# EAGLE design lia (EAGLE 6.2)

## Sheet 1 of 3
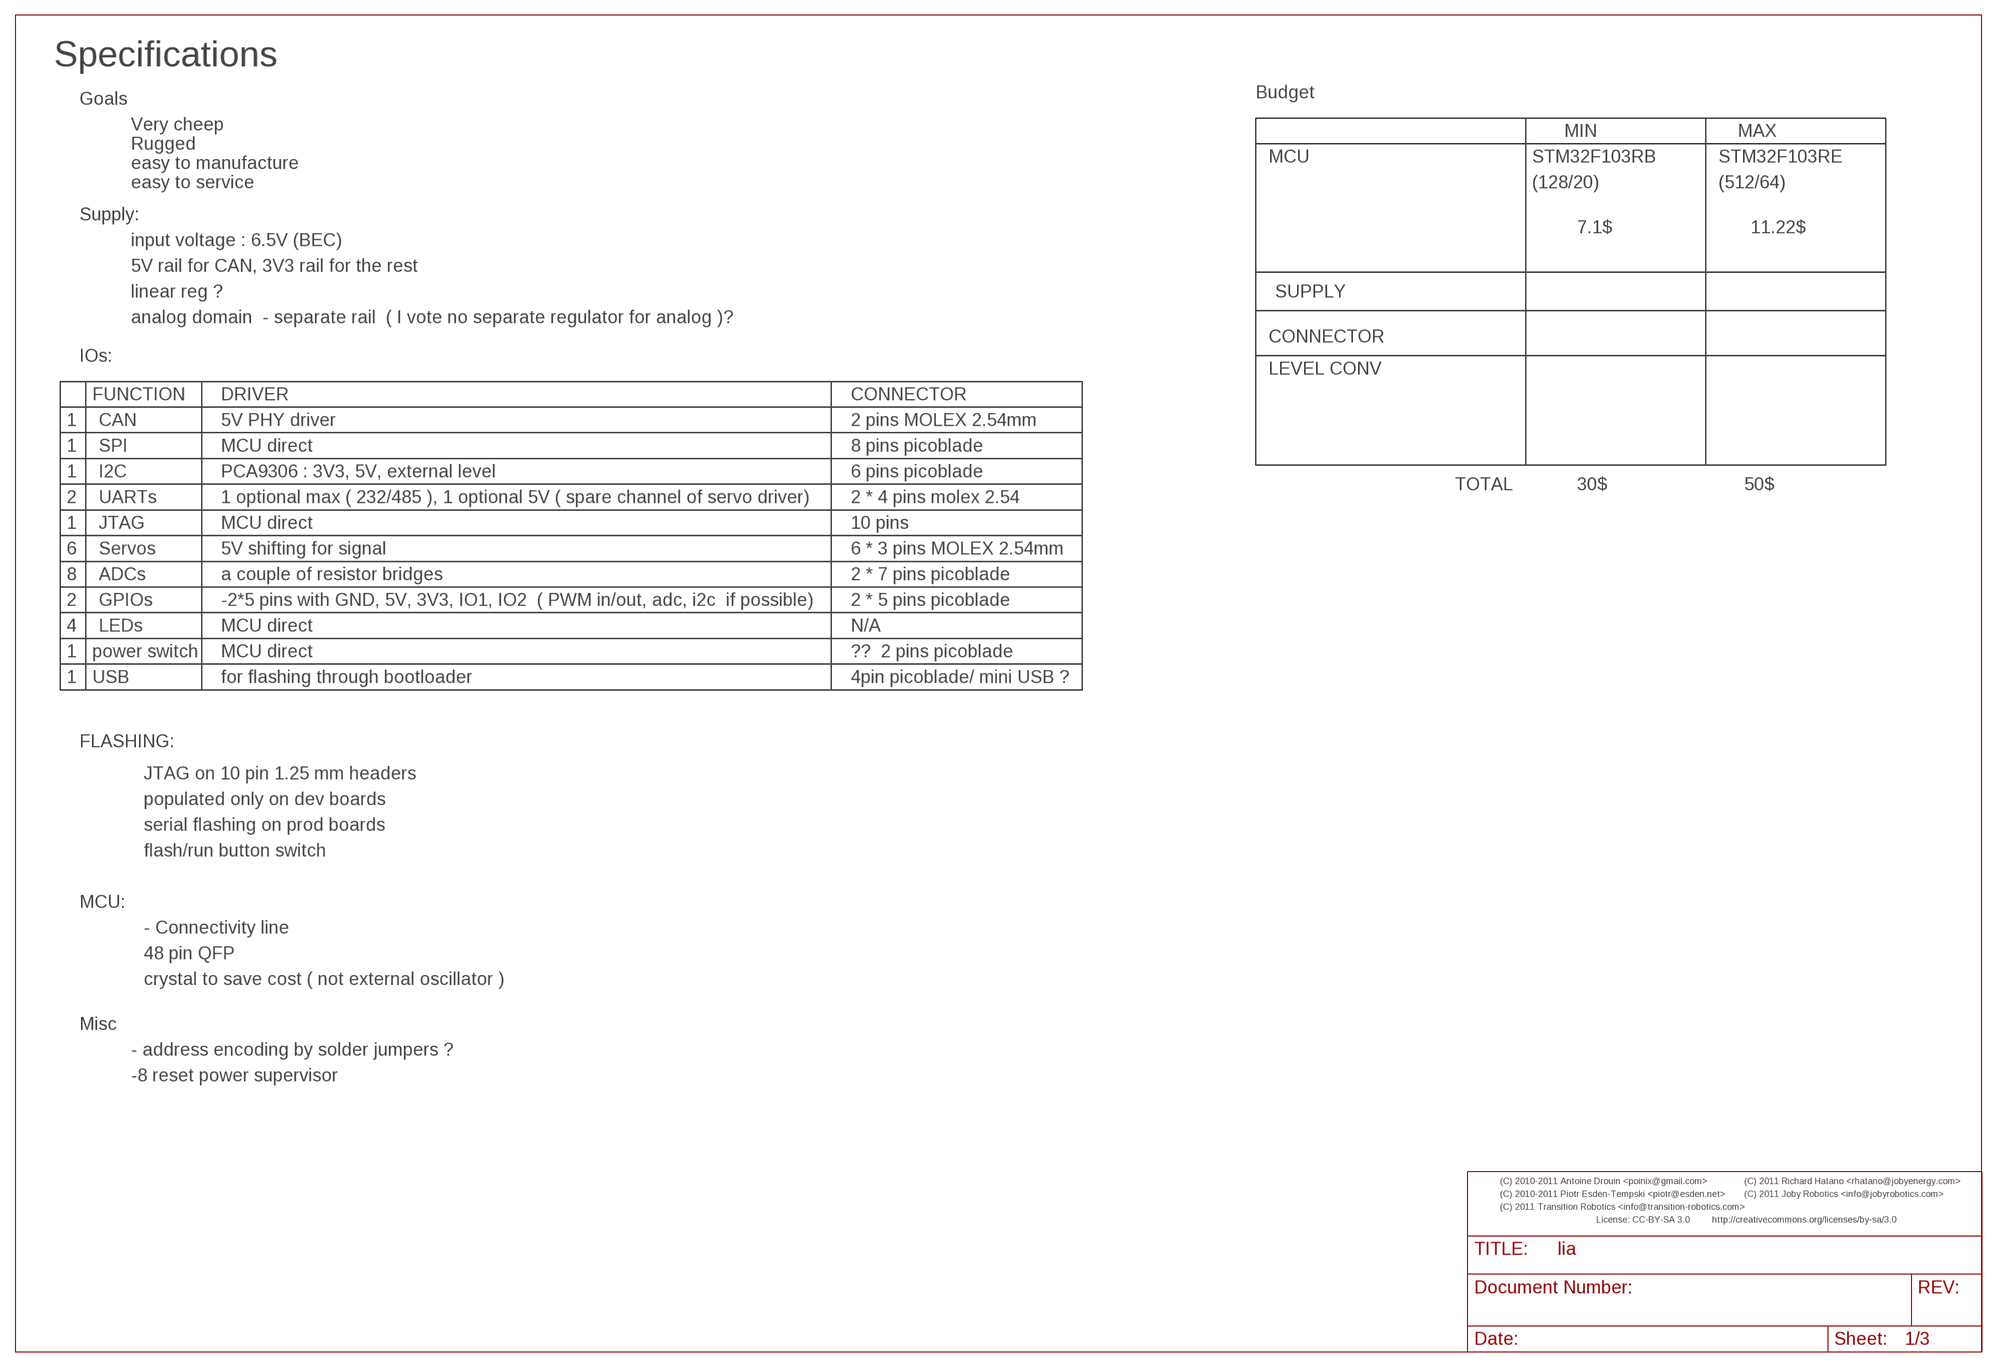
[diagram p0: schematic, sheet 1]

### Notes on the sheet
- Specifications
- Budget
- Goals
- Very cheep
- MIN | MAX
- Rugged
- MCU | STM32F103RB | STM32F103RE
- easy to manufacture
- easy to service | (128/20) | (512/64)
- Supply:
- 7.1$ | 11.22$
- input voltage : 6.5V (BEC)
- 5V rail for CAN, 3V3 rail for the rest
- linear reg ? | SUPPLY
- analog domain  - separate rail  ( I vote no separate regulator for analog )?
- CONNECTOR
- IOs:
- LEVEL CONV
- FUNCTION | DRIVER | CONNECTOR
- 1 | CAN | 5V PHY driver | 2 pins MOLEX 2.54mm
- 1 | SPI | MCU direct | 8 pins picoblade
- 1 | I2C | PCA9306 : 3V3, 5V, external level | 6 pins picoblade
- TOTAL | 30$ | 50$
- 2 | UARTs | 1 optional max ( 232/485 ), 1 optional 5V ( spare channel of servo driver) | 2 * 4 pins molex 2.54
- 1 | JTAG | MCU direct | 10 pins
- 6 | Servos | 5V shifting for signal | 6 * 3 pins MOLEX 2.54mm
- 8 | ADCs | a couple of resistor bridges | 2 * 7 pins picoblade
- 2 | GPIOs | -2*5 pins with GND, 5V, 3V3, IO1, IO2  ( PWM in/out, adc, i2c  if possible) | 2 * 5 pins picoblade
- 4 | LEDs | MCU direct | N/A
- 1 | power switch | MCU direct | ??  2 pins picoblade
- 1 | USB | for flashing through bootloader | 4pin picoblade/ mini USB ?
- FLASHING:
- JTAG on 10 pin 1.25 mm headers
- populated only on dev boards
- serial flashing on prod boards
- flash/run button switch
- MCU:
- - Connectivity line
- 48 pin QFP
- crystal to save cost ( not external oscillator )
- Misc
- - address encoding by solder jumpers ?
- -8 reset power supervisor
- (C) 2010-2011 Antoine Drouin <poinix@gmail.com> | (C) 2011 Richard Hatano <rhatano@jobyenergy.com>
- (C) 2010-2011 Piotr Esden-Tempski <piotr@esden.net> | (C) 2011 Joby Robotics <info@jobyrobotics.com>
- (C) 2011 Transition Robotics <info@transition-robotics.com>
- License: CC-BY-SA 3.0 | http://creativecommons.org/licenses/by-sa/3.0

## Sheet 2 of 3
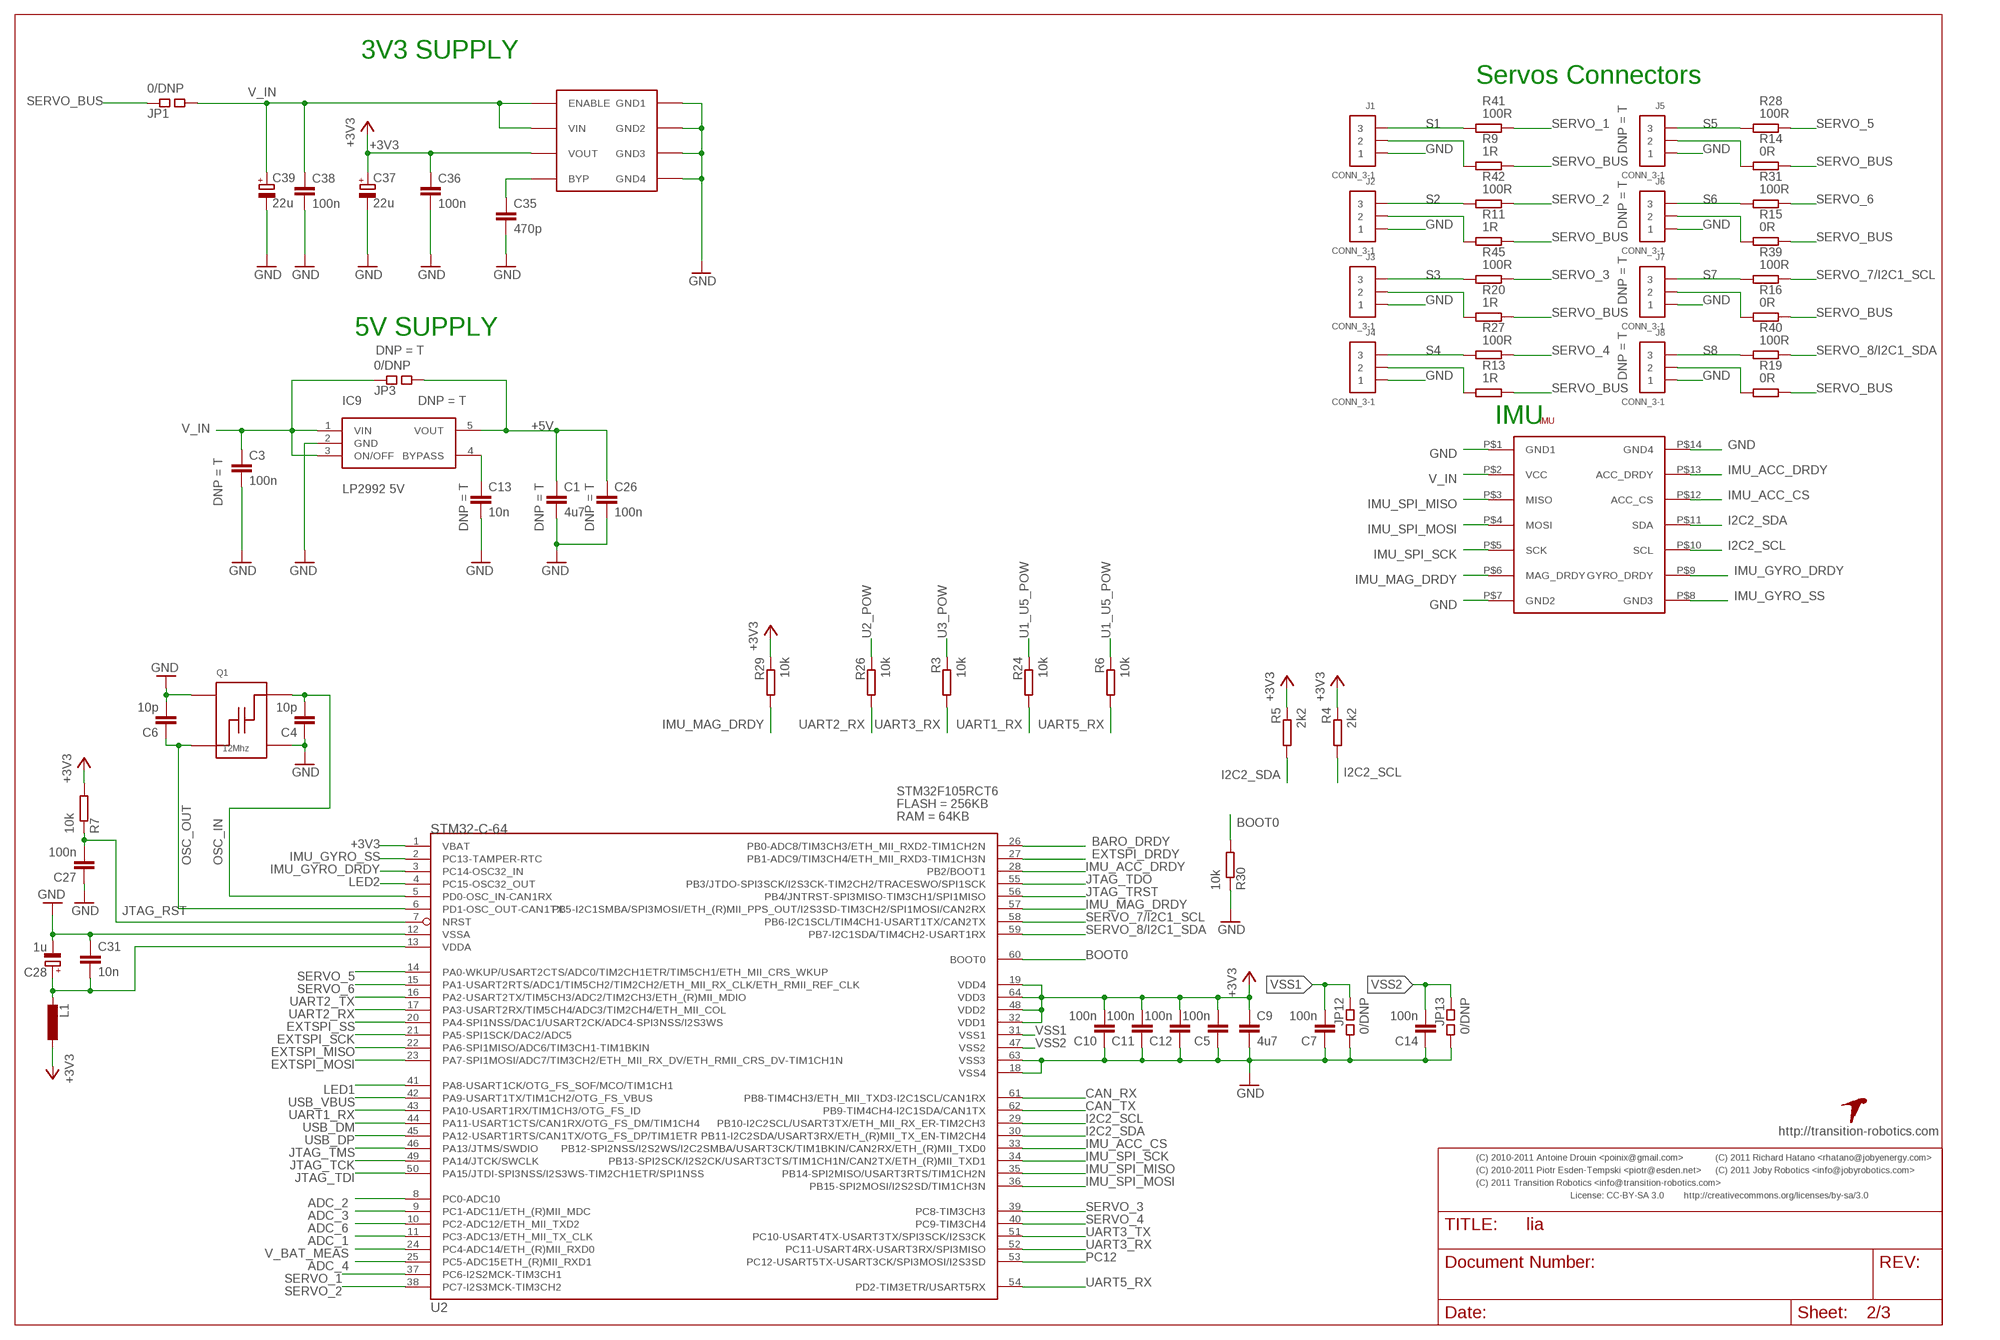
[diagram p1: schematic, sheet 2]

### Parts
C1  4u7  CAPACITOR-0805  [0805-CAP]
C3  100n  CAPACITOR-0603  [0603-CAP]
C4  10p  CAPACITOR-0402  [0402-CAP]
C5  100n  CAPACITOR-0402  [0402-CAP]
C6  10p  CAPACITOR-0402  [0402-CAP]
C7  100n  CAPACITOR-0402  [0402-CAP]
C9  4u7  CAPACITOR-0805  [0805-CAP]
C10  100n  CAPACITOR-0402  [0402-CAP]
C11  100n  CAPACITOR-0402  [0402-CAP]
C12  100n  CAPACITOR-0402  [0402-CAP]
C13  10n  CAPACITOR-0402  [0402-CAP]
C14  100n  CAPACITOR-0402  [0402-CAP]
C26  100n  CAPACITOR-0603  [0603-CAP]
C27  100n  CAPACITOR-0402  [0402-CAP]
C28  1u  CAPACITOR-POL-0603  [0603-POL-CAP]
C31  10n  CAPACITOR-0402  [0402-CAP]
C35  470p  CAPACITOR-0402  [0402-CAP]
C36  100n  CAPACITOR-0603  [0603-CAP]
C37  22u  CAPACITOR-POLB  [3528/B]
C38  100n  CAPACITOR-0402  [0402-CAP]
C39  22u  CAPACITOR-POLB  [3528/B]
IC9  LP2992 5V  LP2992  [SOT23-5]
IMU  ASPIRIN  [ASPIRIN_1]
J1  CONN_3-1  [SIP1X3_100]
J2  CONN_3-1  [SIP1X3_100]
J3  CONN_3-1  [SIP1X3_100]
J4  CONN_3-1  [SIP1X3_100]
J5  CONN_3-1  [SIP1X3_100]
J6  CONN_3-1  [SIP1X3_100]
J7  CONN_3-1  [SIP1X3_100]
J8  CONN_3-1  [SIP1X3_100]
JP1  0/DNP  SQ_JMP-0402  [0402-SQJMP]
JP3  0/DNP  SQ_JMP-0402  [0402-SQJMP]
JP12  0/DNP  SQ_JMP-0402  [0402-SQJMP]
JP13  0/DNP  SQ_JMP-0402  [0402-SQJMP]
L1  INDUCTOR-0603  [0603-IND]
Q1  12Mhz  ABM8  [ABM8]
R3  10k  RESISTOR-0402  [0402-RES]
R4  2k2  RESISTOR-0402  [0402-RES]
R5  2k2  RESISTOR-0402  [0402-RES]
R6  10k  RESISTOR-0402  [0402-RES]
R7  10k  RESISTOR-0402  [0402-RES]
R9  1R  RESISTOR-1206  [1206-RES]
R11  1R  RESISTOR-1206  [1206-RES]
R13  1R  RESISTOR-1206  [1206-RES]
R14  0R  RESISTOR-1206  [1206-RES]
R15  0R  RESISTOR-1206  [1206-RES]
R16  0R  RESISTOR-1206  [1206-RES]
R19  0R  RESISTOR-1206  [1206-RES]
R20  1R  RESISTOR-1206  [1206-RES]
R24  10k  RESISTOR-0402  [0402-RES]
R26  10k  RESISTOR-0402  [0402-RES]
R27  100R  RESISTOR-0402  [0402-RES]
R28  100R  RESISTOR-0402  [0402-RES]
R29  10k  RESISTOR-0402  [0402-RES]
R30  10k  RESISTOR-0402  [0402-RES]
R31  100R  RESISTOR-0402  [0402-RES]
R39  100R  RESISTOR-0402  [0402-RES]
R40  100R  RESISTOR-0402  [0402-RES]
R41  100R  RESISTOR-0402  [0402-RES]
R42  100R  RESISTOR-0402  [0402-RES]
R45  100R  RESISTOR-0402  [0402-RES]
U2  STM32-C-64  [LQFP64]
U$1  TR-LOGO  [TR-LOGO]
VREG1  MIC5209  [SOIC8]

### Nets
+3V3: C5.P$2 C9.P$1 C10.P$2 C11.P$2 C12.P$2 C36.P$1 C37.+ L1.P$1 R4.P$1 R5.P$1 R7.P$2 R29.P$1 U2.1(VBAT) U2.19(VDD4) U2.32(VDD1) U2.48(VDD2) U2.64(VDD3) VREG1.3(VOUT) ; also sheet 3
+5V: C1.P$1 C26.P$1 IC9.5(VOUT) JP3.P$2 ; also sheet 3
ADC_1: U2.11(PC3-ADC13/ETH_MII_TX_CLK) ; also sheet 3
ADC_2: U2.8(PC0-ADC10) ; also sheet 3
ADC_3: U2.9(PC1-ADC11/ETH_(R)MII_MDC) ; also sheet 3
ADC_4: U2.25(PC5-ADC15ETH_(R)MII_RXD1) ; also sheet 3
ADC_6: U2.10(PC2-ADC12/ETH_MII_TXD2) ; also sheet 3
BARO_DRDY: U2.26(PB0-ADC8/TIM3CH3/ETH_MII_RXD2-TIM1CH2N)
BOOT0: R30.P$2 U2.60(BOOT0) ; also sheet 3
CAN_RX: U2.61(PB8-TIM4CH3/ETH_MII_TXD3-I2C1SCL/CAN1RX) ; also sheet 3
CAN_TX: U2.62(PB9-TIM4CH4-I2C1SDA/CAN1TX) ; also sheet 3
EXTSPI_DRDY: U2.27(PB1-ADC9/TIM3CH4/ETH_MII_RXD3-TIM1CH3N) ; also sheet 3
EXTSPI_MISO: U2.22(PA6-SPI1MISO/ADC6/TIM3CH1-TIM1BKIN) ; also sheet 3
EXTSPI_MOSI: U2.23(PA7-SPI1MOSI/ADC7/TIM3CH2/ETH_MII_RX_DV/ETH_RMII_CRS_DV-TIM1CH1N) ; also sheet 3
EXTSPI_SCK: U2.21(PA5-SPI1SCK/DAC2/ADC5) ; also sheet 3
EXTSPI_SS: U2.20(PA4-SPI1NSS/DAC1/USART2CK/ADC4-SPI3NSS/I2S3WS) ; also sheet 3
GND: C1.P$2 C3.P$2 C4.P$1 C5.P$1 C6.P$2 C7.P$1 C9.P$2 C10.P$1 C11.P$1 C12.P$1 C13.P$2 C14.P$1 C26.P$2 C27.P$1 C28.- C31.P$1 C35.P$2 C36.P$2 C37.- C38.P$2 C39.- IC9.2(GND) IMU.P$1(GND1) IMU.P$7(GND2) IMU.P$14(GND4) J1.1 J2.1 J3.1 J4.1 J5.1 J6.1 J7.1 J8.1 JP12.P$2 JP13.P$2 Q1.P$2 Q1.P$4 R30.P$1 U2.12(VSSA) U2.18(VSS4) U2.63(VSS3) VREG1.5(GND4) VREG1.6(GND3) VREG1.7(GND2) VREG1.8(GND1) ; also sheet 3
I2C2_SCL: IMU.P$10(SCL) R4.P$2 U2.29(PB10-I2C2SCL/USART3TX/ETH_MII_RX_ER-TIM2CH3) ; also sheet 3
I2C2_SDA: IMU.P$11(SDA) R5.P$2 U2.30(PB11-I2C2SDA/USART3RX/ETH_(R)MII_TX_EN-TIM2CH4) ; also sheet 3
IMU_ACC_CS: IMU.P$12(ACC_CS) U2.33(PB12-SPI2NSS/I2S2WS/I2C2SMBA/USART3CK/TIM1BKIN/CAN2RX/ETH_(R)MII_TXD0)
IMU_ACC_DRDY: IMU.P$13(ACC_DRDY) U2.28(PB2/BOOT1)
IMU_GYRO_DRDY: IMU.P$9(GYRO_DRDY) U2.3(PC14-OSC32_IN)
IMU_GYRO_SS: IMU.P$8(GND3) U2.2(PC13-TAMPER-RTC)
IMU_MAG_DRDY: IMU.P$6(MAG_DRDY) R29.P$2 U2.57(PB5-I2C1SMBA/SPI3MOSI/ETH_(R)MII_PPS_OUT/I2S3SD-TIM3CH2/SPI1MOSI/CAN2RX)
IMU_SPI_MISO: IMU.P$3(MISO) U2.35(PB14-SPI2MISO/USART3RTS/TIM1CH2N)
IMU_SPI_MOSI: IMU.P$4(MOSI) U2.36(PB15-SPI2MOSI/I2S2SD/TIM1CH3N)
IMU_SPI_SCK: IMU.P$5(SCK) U2.34(PB13-SPI2SCK/I2S2CK/USART3CTS/TIM1CH1N/CAN2TX/ETH_(R)MII_TXD1)
JTAG_RST: C27.P$2 R7.P$1 U2.7(NRST) ; also sheet 3
JTAG_TCK: U2.49(PA14/JTCK/SWCLK) ; also sheet 3
JTAG_TDI: U2.50(PA15/JTDI-SPI3NSS/I2S3WS-TIM2CH1ETR/SPI1NSS) ; also sheet 3
JTAG_TDO: U2.55(PB3/JTDO-SPI3SCK/I2S3CK-TIM2CH2/TRACESWO/SPI1SCK) ; also sheet 3
JTAG_TMS: U2.46(PA13/JTMS/SWDIO) ; also sheet 3
JTAG_TRST: U2.56(PB4/JNTRST-SPI3MISO-TIM3CH1/SPI1MISO) ; also sheet 3
LED1: U2.41(PA8-USART1CK/OTG_FS_SOF/MCO/TIM1CH1) ; also sheet 3
LED2: U2.4(PC15-OSC32_OUT) ; also sheet 3
N$2: J5.2 R14.P$1
N$3: J6.2 R15.P$1
N$6: C13.P$1 IC9.4(BYPASS)
N$7: C35.P$1 VREG1.4(BYP)
N$16: J7.2 R16.P$1
N$17: J8.2 R19.P$1
N$18: J4.2 R13.P$1
N$19: J3.2 R20.P$1
N$20: J2.2 R11.P$1
N$21: J1.2 R9.P$1
OSC_IN: C4.P$2 Q1.P$3 U2.5(PD0-OSC_IN-CAN1RX)
OSC_OUT: C6.P$1 Q1.P$1 U2.6(PD1-OSC_OUT-CAN1TX)
PC12: U2.53(PC12-USART5TX-USART3CK/SPI3MOSI/I2S3SD) ; also sheet 3
S1: J1.3 R41.P$1
S2: J2.3 R42.P$1
S3: J3.3 R45.P$1
S4: J4.3 R27.P$1
S5: J5.3 R28.P$1
S6: J6.3 R31.P$1
S7: J7.3 R39.P$1
S8: J8.3 R40.P$1
SERVO_1: R41.P$2 U2.37(PC6-I2S2MCK-TIM3CH1)
SERVO_2: R42.P$2 U2.38(PC7-I2S3MCK-TIM3CH2)
SERVO_3: R45.P$2 U2.39(PC8-TIM3CH3)
SERVO_4: R27.P$2 U2.40(PC9-TIM3CH4)
SERVO_5: R28.P$2 U2.14(PA0-WKUP/USART2CTS/ADC0/TIM2CH1ETR/TIM5CH1/ETH_MII_CRS_WKUP)
SERVO_6: R31.P$2 U2.15(PA1-USART2RTS/ADC1/TIM5CH2/TIM2CH2/ETH_MII_RX_CLK/ETH_RMII_REF_CLK)
SERVO_7/I2C1_SCL: R39.P$2 U2.58(PB6-I2C1SCL/TIM4CH1-USART1TX/CAN2TX) ; also sheet 3
SERVO_8/I2C1_SDA: R40.P$2 U2.59(PB7-I2C1SDA/TIM4CH2-USART1RX) ; also sheet 3
SERVO_BUS: JP1.P$1 R9.P$2 R11.P$2 R13.P$2 R14.P$2 R15.P$2 R16.P$2 R19.P$2 R20.P$2
U1_U5_POW: R6.P$1 R24.P$1 ; also sheet 3
U2_POW: R26.P$1 ; also sheet 3
U3_POW: R3.P$1 ; also sheet 3
UART1_RX: R24.P$2 U2.43(PA10-USART1RX/TIM1CH3/OTG_FS_ID) ; also sheet 3
UART2_RX: R26.P$2 U2.17(PA3-USART2RX/TIM5CH4/ADC3/TIM2CH4/ETH_MII_COL) ; also sheet 3
UART2_TX: U2.16(PA2-USART2TX/TIM5CH3/ADC2/TIM2CH3/ETH_(R)MII_MDIO) ; also sheet 3
UART3_RX: R3.P$2 U2.52(PC11-USART4RX-USART3RX/SPI3MISO) ; also sheet 3
UART3_TX: U2.51(PC10-USART4TX-USART3TX/SPI3SCK/I2S3CK) ; also sheet 3
UART5_RX: R6.P$2 U2.54(PD2-TIM3ETR/USART5RX) ; also sheet 3
USB_DM: U2.44(PA11-USART1CTS/CAN1RX/OTG_FS_DM/TIM1CH4) ; also sheet 3
USB_DP: U2.45(PA12-USART1RTS/CAN1TX/OTG_FS_DP/TIM1ETR) ; also sheet 3
USB_VBUS: U2.42(PA9-USART1TX/TIM1CH2/OTG_FS_VBUS) ; also sheet 3
V_BAT_MEAS: U2.24(PC4-ADC14/ETH_(R)MII_RXD0) ; also sheet 3
V_IN: C3.P$1 C38.P$1 C39.+ IC9.1(VIN) IC9.3(ON/OFF) IMU.P$2(VCC) JP1.P$2 JP3.P$1 VREG1.1(ENABLE) VREG1.2(VIN) ; also sheet 3
VDDA: C28.+ C31.P$2 L1.P$2 U2.13(VDDA)
VSS1: C7.P$2 JP12.P$1 U2.31(VSS1)
VSS2: C14.P$2 JP13.P$1 U2.47(VSS2)

### Notes on the sheet
- 3V3 SUPPLY
- Servos Connectors
- 5V SUPPLY
- IMU
- http://transition-robotics.com
- (C) 2010-2011 Antoine Drouin <poinix@gmail.com> | (C) 2011 Richard Hatano <rhatano@jobyenergy.com>
- (C) 2010-2011 Piotr Esden-Tempski <piotr@esden.net> | (C) 2011 Joby Robotics <info@jobyrobotics.com>
- (C) 2011 Transition Robotics <info@transition-robotics.com>
- License: CC-BY-SA 3.0 | http://creativecommons.org/licenses/by-sa/3.0

## Sheet 3 of 3
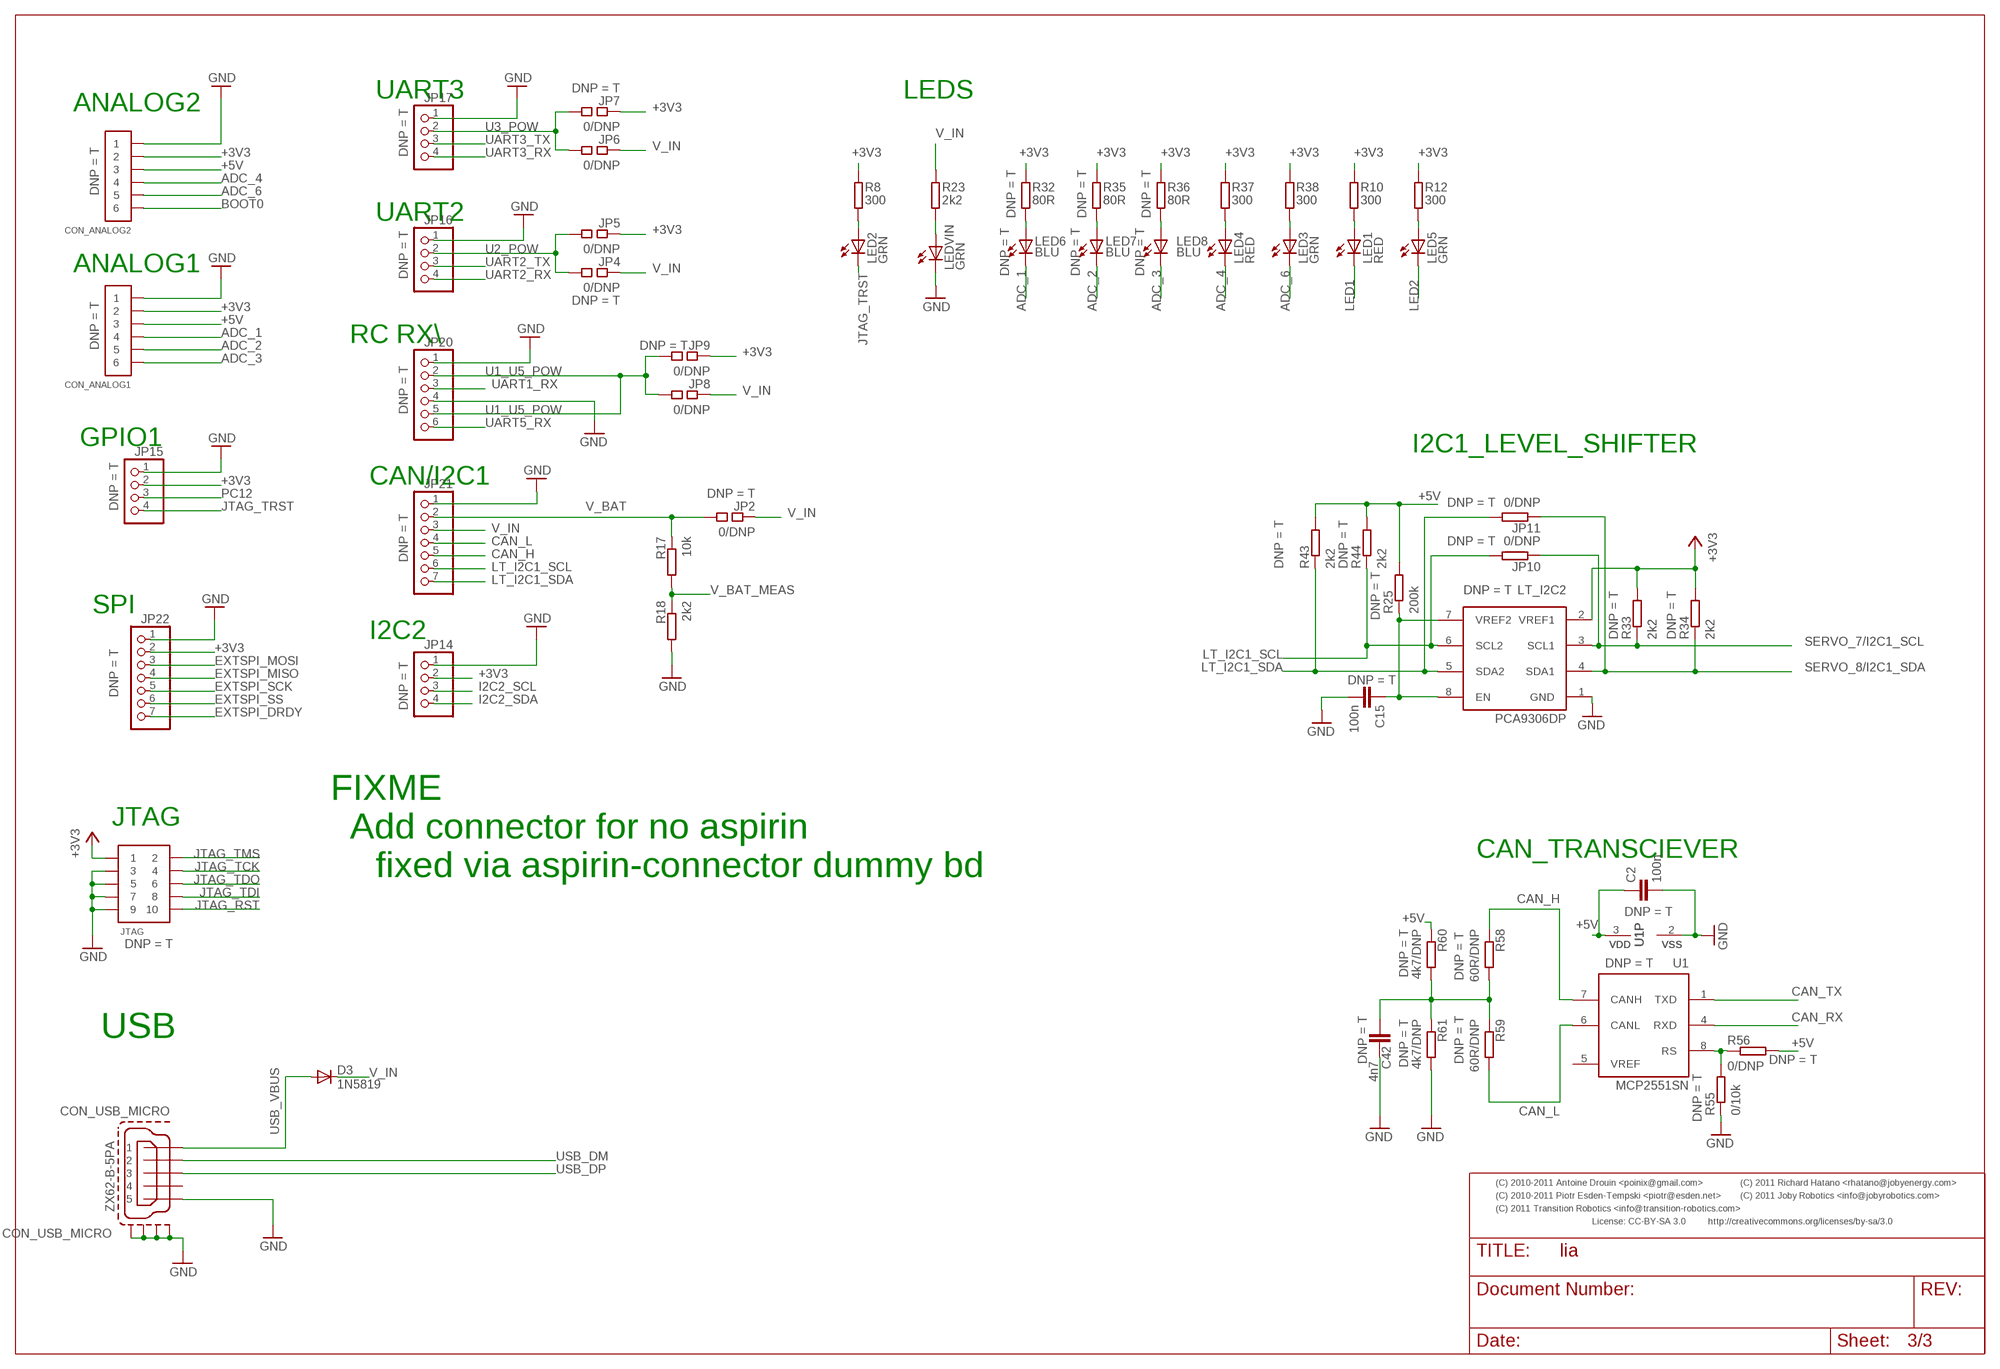
[diagram p2: schematic, sheet 3]

### Parts
C2  100n  CAPACITOR-0402  [0402-CAP]
C15  100n  CAPACITOR-0402  [0402-CAP]
C42  4n7  CAPACITOR-0603  [0603-CAP]
CON_ANALOG1  CONN_6-1-53398  [PB-53398-06]
CON_ANALOG2  CONN_6-1-53398  [PB-53398-06]
CON_USB_MICRO  ZX62-B-5PA  [ZX62-B-5PA]
D3  1N5819  DIODE-MICROMELF-R  [MICROMELF-R]
JP2  0/DNP  SQ_JMP-0402  [0402-SQJMP]
JP4  0/DNP  SQ_JMP-0402  [0402-SQJMP]
JP5  0/DNP  SQ_JMP-0402  [0402-SQJMP]
JP6  0/DNP  SQ_JMP-0402  [0402-SQJMP]
JP7  0/DNP  SQ_JMP-0402  [0402-SQJMP]
JP8  0/DNP  SQ_JMP-0402  [0402-SQJMP]
JP9  0/DNP  SQ_JMP-0402  [0402-SQJMP]
JP10  0/DNP  RESISTOR-0603  [0603-RES]
JP11  0/DNP  RESISTOR-0603  [0603-RES]
JP14  PINHD-1X4  [1X04]
JP15  PINHD-1X4  [1X04]
JP16  PINHD-1X4  [1X04]
JP17  PINHD-1X4  [1X04]
JP20  PINHD-1X6  [1X06]
JP21  PINHD-1X7  [1X07]
JP22  PINHD-1X7  [1X07]
JTAG  PIN_HDR_EDG_1.27MM_5-2  CONN_5-2-FTSH-V  [FTSH-105-DV]
LED1  RED  LED-0402  [0402-LED]
LED2  GRN  LED-0402  [0402-LED]
LED3  GRN  LED-0402  [0402-LED]
LED4  RED  LED-0402  [0402-LED]
LED5  GRN  LED-0402  [0402-LED]
LED6  BLU  LED-0402  [0402-LED]
LED7  BLU  LED-0402  [0402-LED]
LED8  BLU  LED-0402  [0402-LED]
LEDVIN  GRN  LED-0402  [0402-LED]
LT_I2C2  PCA9306DP  [TSSOP_B3]
R8  300  RESISTOR-0402  [0402-RES]
R10  300  RESISTOR-0402  [0402-RES]
R12  300  RESISTOR-0402  [0402-RES]
R17  10k  RESISTOR-0402  [0402-RES]
R18  2k2  RESISTOR-0402  [0402-RES]
R23  2k2  RESISTOR-0402  [0402-RES]
R25  200k  RESISTOR-0402  [0402-RES]
R32  80R  RESISTOR-0402  [0402-RES]
R33  2k2  RESISTOR-0402  [0402-RES]
R34  2k2  RESISTOR-0402  [0402-RES]
R35  80R  RESISTOR-0402  [0402-RES]
R36  80R  RESISTOR-0402  [0402-RES]
R37  300  RESISTOR-0402  [0402-RES]
R38  300  RESISTOR-0402  [0402-RES]
R43  2k2  RESISTOR-0402  [0402-RES]
R44  2k2  RESISTOR-0402  [0402-RES]
R55  0/10k  RESISTOR-0402  [0402-RES]
R56  0/DNP  RESISTOR-0402  [0402-RES]
R58  60R/DNP  RESISTOR-0402  [0402-RES]
R59  60R/DNP  RESISTOR-0402  [0402-RES]
R60  4k7/DNP  RESISTOR-0402  [0402-RES]
R61  4k7/DNP  RESISTOR-0402  [0402-RES]
U1  MCP2551SN  [SO-08]

### Nets
+3V3: CON_ANALOG1.2 CON_ANALOG2.2 JP5.P$1 JP7.P$1 JP9.P$1 JP14.2 JP15.2 JP22.2 JTAG.1 LT_I2C2.2(VREF1) R8.P$2 R10.P$2 R12.P$2 R32.P$2 R33.P$2 R34.P$2 R35.P$2 R36.P$2 R37.P$2 R38.P$2 ; also sheet 2
+5V: C2.P$1 CON_ANALOG1.3 CON_ANALOG2.3 R25.P$2 R43.P$2 R44.P$2 R56.P$2 R60.P$1 U1.3(VDD) ; also sheet 2
ADC_1: CON_ANALOG1.4 LED6.C ; also sheet 2
ADC_2: CON_ANALOG1.5 LED7.C ; also sheet 2
ADC_3: CON_ANALOG1.6 LED8.C ; also sheet 2
ADC_4: CON_ANALOG2.4 LED4.C ; also sheet 2
ADC_6: CON_ANALOG2.5 LED3.C ; also sheet 2
BOOT0: CON_ANALOG2.6 ; also sheet 2
CAN_CENTER: C42.P$2 R58.P$2 R59.P$1 R60.P$2 R61.P$1
CAN_H: JP21.5 R58.P$1 U1.7(CANH)
CAN_L: JP21.4 R59.P$2 U1.6(CANL)
CAN_RX: U1.4(RXD) ; also sheet 2
CAN_TX: U1.1(TXD) ; also sheet 2
EXTSPI_DRDY: JP22.7 ; also sheet 2
EXTSPI_MISO: JP22.4 ; also sheet 2
EXTSPI_MOSI: JP22.3 ; also sheet 2
EXTSPI_SCK: JP22.5 ; also sheet 2
EXTSPI_SS: JP22.6 ; also sheet 2
GND: C2.P$2 C15.P$2 C42.P$1 CON_ANALOG1.1 CON_ANALOG2.1 CON_USB_MICRO.GND_LEFT(S1) CON_USB_MICRO.GND_RIGHT(S2) CON_USB_MICRO.GND_UP_LEFT(S3) CON_USB_MICRO.GND_UP_RIGHT(S4) CON_USB_MICRO.PIN_5 JP14.1 JP15.1 JP16.1 JP17.1 JP20.1 JP20.4 JP21.1 JP22.1 JTAG.3 JTAG.5 JTAG.7 JTAG.9 LEDVIN.C LT_I2C2.1(GND) R18.P$2 R55.P$1 R61.P$2 U1.2(VSS) ; also sheet 2
I2C2_SCL: JP14.3 ; also sheet 2
I2C2_SDA: JP14.4 ; also sheet 2
JTAG_RST: JTAG.10 ; also sheet 2
JTAG_TCK: JTAG.4 ; also sheet 2
JTAG_TDI: JTAG.8 ; also sheet 2
JTAG_TDO: JTAG.6 ; also sheet 2
JTAG_TMS: JTAG.2 ; also sheet 2
JTAG_TRST: JP15.4 LED2.C ; also sheet 2
LED1: LED1.C ; also sheet 2
LED2: LED5.C ; also sheet 2
LT_I2C1_SCL: JP10.P$2 JP21.6 LT_I2C2.6(SCL2) R44.P$1
LT_I2C1_SDA: JP11.P$2 JP21.7 LT_I2C2.5(SDA2) R43.P$1
N$1: R55.P$2 R56.P$1 U1.8(RS)
N$4: LED1.A R10.P$1
N$5: LED6.A R32.P$1
N$8: C15.P$1 LT_I2C2.7(VREF2) LT_I2C2.8(EN) R25.P$1
N$9: LED7.A R35.P$1
N$10: LED2.A R8.P$1
N$11: LED8.A R36.P$1
N$12: LEDVIN.A R23.P$1
N$13: LED5.A R12.P$1
N$14: LED4.A R37.P$1
N$15: LED3.A R38.P$1
PC12: JP15.3 ; also sheet 2
SERVO_7/I2C1_SCL: JP10.P$1 LT_I2C2.3(SCL1) R33.P$1 ; also sheet 2
SERVO_8/I2C1_SDA: JP11.P$1 LT_I2C2.4(SDA1) R34.P$1 ; also sheet 2
U1_U5_POW: JP8.P$2 JP9.P$2 JP20.2 JP20.5 ; also sheet 2
U2_POW: JP4.P$2 JP5.P$2 JP16.2 ; also sheet 2
U3_POW: JP6.P$2 JP7.P$2 JP17.2 ; also sheet 2
UART1_RX: JP20.3 ; also sheet 2
UART2_RX: JP16.4 ; also sheet 2
UART2_TX: JP16.3 ; also sheet 2
UART3_RX: JP17.4 ; also sheet 2
UART3_TX: JP17.3 ; also sheet 2
UART5_RX: JP20.6 ; also sheet 2
USB_DM: CON_USB_MICRO.PIN_2 ; also sheet 2
USB_DP: CON_USB_MICRO.PIN_3 ; also sheet 2
USB_VBUS: CON_USB_MICRO.PIN_1 D3.A ; also sheet 2
V_BAT: JP2.P$2 JP21.2 R17.P$1
V_BAT_MEAS: R17.P$2 R18.P$1 ; also sheet 2
V_IN: D3.C JP2.P$1 JP4.P$1 JP6.P$1 JP8.P$1 JP21.3 R23.P$2 ; also sheet 2
Unconnected: CON_USB_MICRO.PIN_4

### Notes on the sheet
- ANALOG2 | UART3 | LEDS
- UART2
- ANALOG1
- RC RX\
- GPIO1 | I2C1_LEVEL_SHIFTER
- CAN/I2C1
- SPI
- I2C2
- FIXME
- JTAG
- Add connector for no aspirin
- CAN_TRANSCIEVER
- fixed via aspirin-connector dummy bd
- USB
- (C) 2010-2011 Antoine Drouin <poinix@gmail.com> | (C) 2011 Richard Hatano <rhatano@jobyenergy.com>
- (C) 2010-2011 Piotr Esden-Tempski <piotr@esden.net> | (C) 2011 Joby Robotics <info@jobyrobotics.com>
- (C) 2011 Transition Robotics <info@transition-robotics.com>
- License: CC-BY-SA 3.0 | http://creativecommons.org/licenses/by-sa/3.0

## Power pins joined to a net without a drawn wire
VREF: U1.5(VREF)

## Library data of the parts
C1 = pel_dipol_comp:CAPACITOR; DNP: T; PARTNO: cap-cer-0805-4u7
C2 C15 = pel_dipol_comp:CAPACITOR; DNP: T; PARTNO: cap-cer-0402-100n
C3 C26 = pel_dipol_comp:CAPACITOR; DNP: T; PARTNO: cap-cer-0603-100n
C4 C6 = pel_dipol_comp:CAPACITOR; PARTNO: cap-cer-0402-10p
C5 C7 C10-C12 C14 C27 C38 = pel_dipol_comp:CAPACITOR; PARTNO: cap-cer-0402-100n
C9 = pel_dipol_comp:CAPACITOR; PARTNO: cap-cer-0805-4u7
C13 = pel_dipol_comp:CAPACITOR; DNP: T; PARTNO: cap-cer-0402-10n
C28 = pel_dipol_comp:CAPACITOR-POL; PARTNO: cap-tan-0603-1u
C31 = pel_dipol_comp:CAPACITOR; PARTNO: cap-cer-0402-10n
C35 = pel_dipol_comp:CAPACITOR; PARTNO: cap-cer-0402-470p
C36 = pel_dipol_comp:CAPACITOR; PARTNO: cap-cer-0603-100n
C37 C39 = pel_dipol_comp:CAPACITOR-POL; PARTNO: cap-tan-B-22u-16v
C42 = pel_dipol_comp:CAPACITOR; DNP: T; PARTNO: cap-cer-0603-4n7
CON_ANALOG1 CON_ANALOG2 = pel_molex:CONN_6-1; DNP: T; PARTNO: conn-picoblade-smd-0.05in-6-vert
CON_USB_MICRO = open-bldc:ZX62-B-5PA; PARTNO: conn-smd-usb-micro-b
D3 = diode:DIODE-: DIODE; PARTNO: diode-schottky-1608
IC9 = open-bldc:LP2992; DNP: T; PARTNO: vreg-sot-23-5-5v
IMU = joby_robotics:ASPIRIN; PARTNO: pcb-ass-aspirin
J1-J4 = pel_misc:CONN_3-1; PARTNO: conn-th-0.1in-3-2-ra
J5-J8 = pel_misc:CONN_3-1; DNP: T; PARTNO: conn-th-0.1in-3-2-ra
JP1 JP5 JP6 JP8 JP12 JP13 = pel_jumpers:SQ_JMP; PARTNO: res-0402-0
JP2-JP4 JP7 JP9 = pel_jumpers:SQ_JMP; DNP: T; PARTNO: res-0402-0
JP10 JP11 = pel_dipol_comp:RESISTOR; DNP: T; PARTNO: res-0603-0
JP14-JP17 = pinhead:PINHD-1X4: PIN HEADER; DNP: T; PARTNO: conn-th-0.1in-4-1
JP20 = pinhead:PINHD-1X6: PIN HEADER; DNP: T; PARTNO: conn-th-0.1in-6-1
JP21 JP22 = pinhead:PINHD-1X7: PIN HEADER; DNP: T; PARTNO: conn-th-0.1in-7-1
JTAG = pel_misc:CONN_5-2; DNP: T; PARTNO: conn-smd-0.05in-5-2
L1 = res_cap:INDUCTOR; PARTNO: ferrite-0603-600ohm
LED1 LED4 = pel_dipol_comp:LED; PARTNO: led-0402-red
LED2 LED3 LED5 LEDVIN = pel_dipol_comp:LED; PARTNO: led-0402-green
LED6-LED8 = pel_dipol_comp:LED; DNP: T; PARTNO: led-0402-blue
LT_I2C2 = booz:PCA9306: Dual bidirectional I2C-bus and SMBus voltage-level translator; DNP: T; PARTNO: ic-tssop8-level-trans
Q1 = booz:ABM8; PARTNO: xtal-abm8-12mhz
R3 R6 R7 R17 R24 R26 R29 R30 = pel_dipol_comp:RESISTOR; PARTNO: res-0402-10k
R4 R5 R18 R23 = pel_dipol_comp:RESISTOR; PARTNO: res-0402-2k2
R8 R10 R12 R37 R38 = pel_dipol_comp:RESISTOR; PARTNO: res-0402-300
R9 R11 R13 R20 = pel_dipol_comp:RESISTOR; PARTNO: res-1206-1
R14-R16 R19 = pel_dipol_comp:RESISTOR; PARTNO: res-1206-0
R25 = pel_dipol_comp:RESISTOR; DNP: T; PARTNO: res-0402-200k
R27 R28 R31 R39-R42 R45 = pel_dipol_comp:RESISTOR; PARTNO: res-0402-100
R32 R35 R36 = pel_dipol_comp:RESISTOR; DNP: T; PARTNO: res-0402-80
R33 R34 = pel_dipol_comp:RESISTOR; DNP: T; PARTNO: res-0402-2k2
R43 R44 = pel_dipol_comp:RESISTOR; DNP: T; PARTNO: res-0402-1k5
R55 = pel_dipol_comp:RESISTOR; DNP: T; PARTNO: res-0402-10k
R56 = pel_dipol_comp:RESISTOR; DNP: T; PARTNO: res-0402-0
R58 R59 = pel_dipol_comp:RESISTOR; DNP: T; PARTNO: res-0402-60.4
R60 R61 = pel_dipol_comp:RESISTOR; DNP: T; PARTNO: res-0402-4k7
U1 = microchip_can:MCP2551: High Speed CAN tranceiver; DNP: T; PARTNO: ic-so8-can
U2 = pel_stm32:STM32-C-64; FLASH: 256KB; PARTNO: mcu-lqfp-64-stm32; PART_NR: STM32F105RCT6; RAM: 64KB
U$1 = quadshot:TR-LOGO; BOM: EXCLUDE; PARTNO: *
VREG1 = paparazzi:MIC5209; PARTNO: vreg-so8-3v3

## Net classes
0 default: width 0.152 mm, drill 0.305 mm, clearance 0.152 mm

## Board
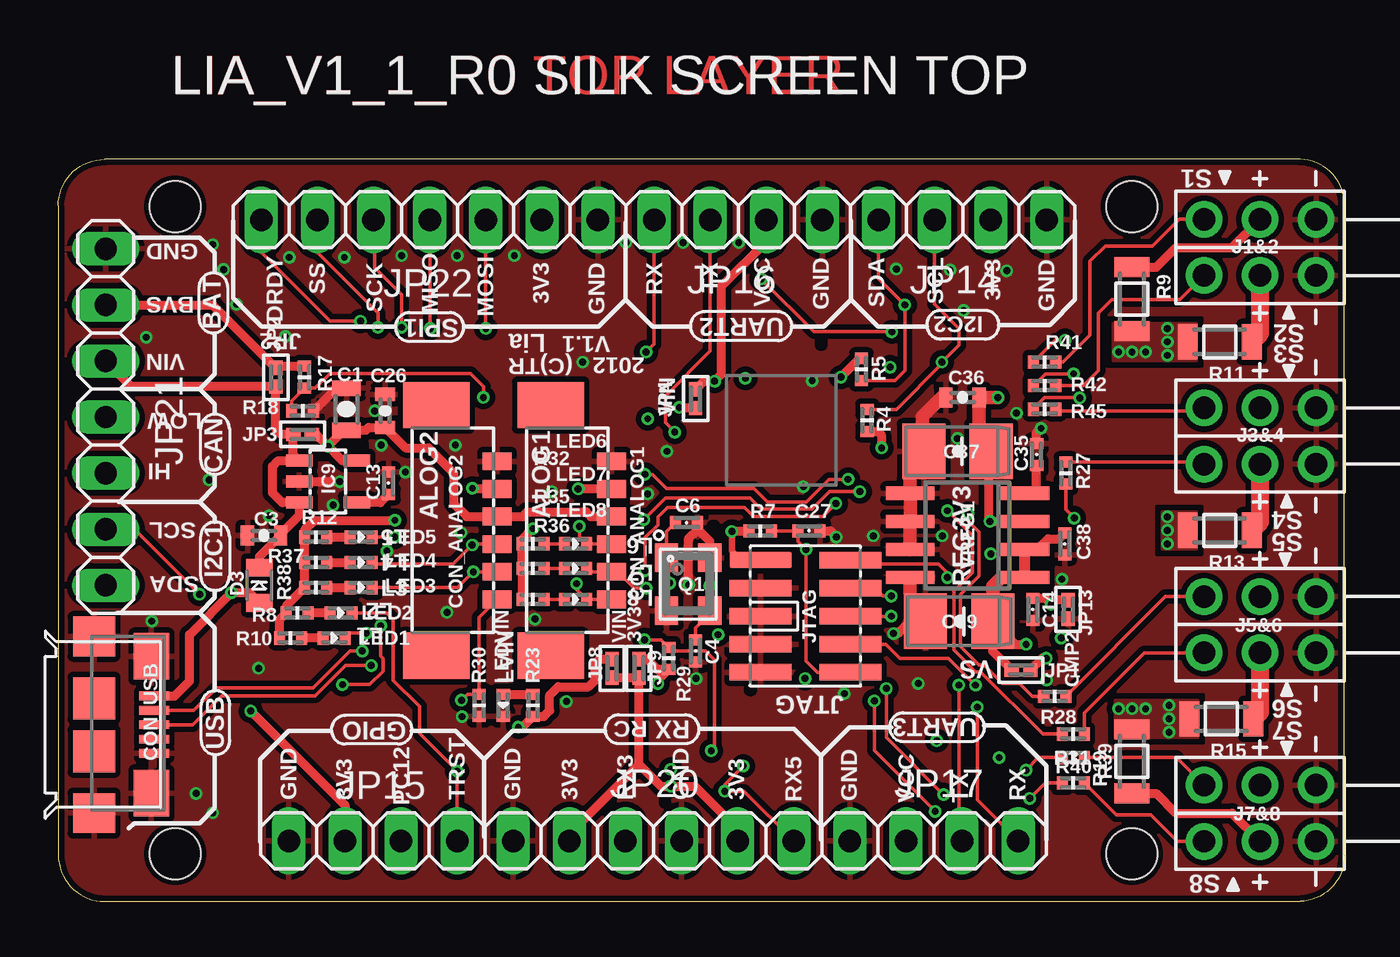
[diagram p3: board, top side]
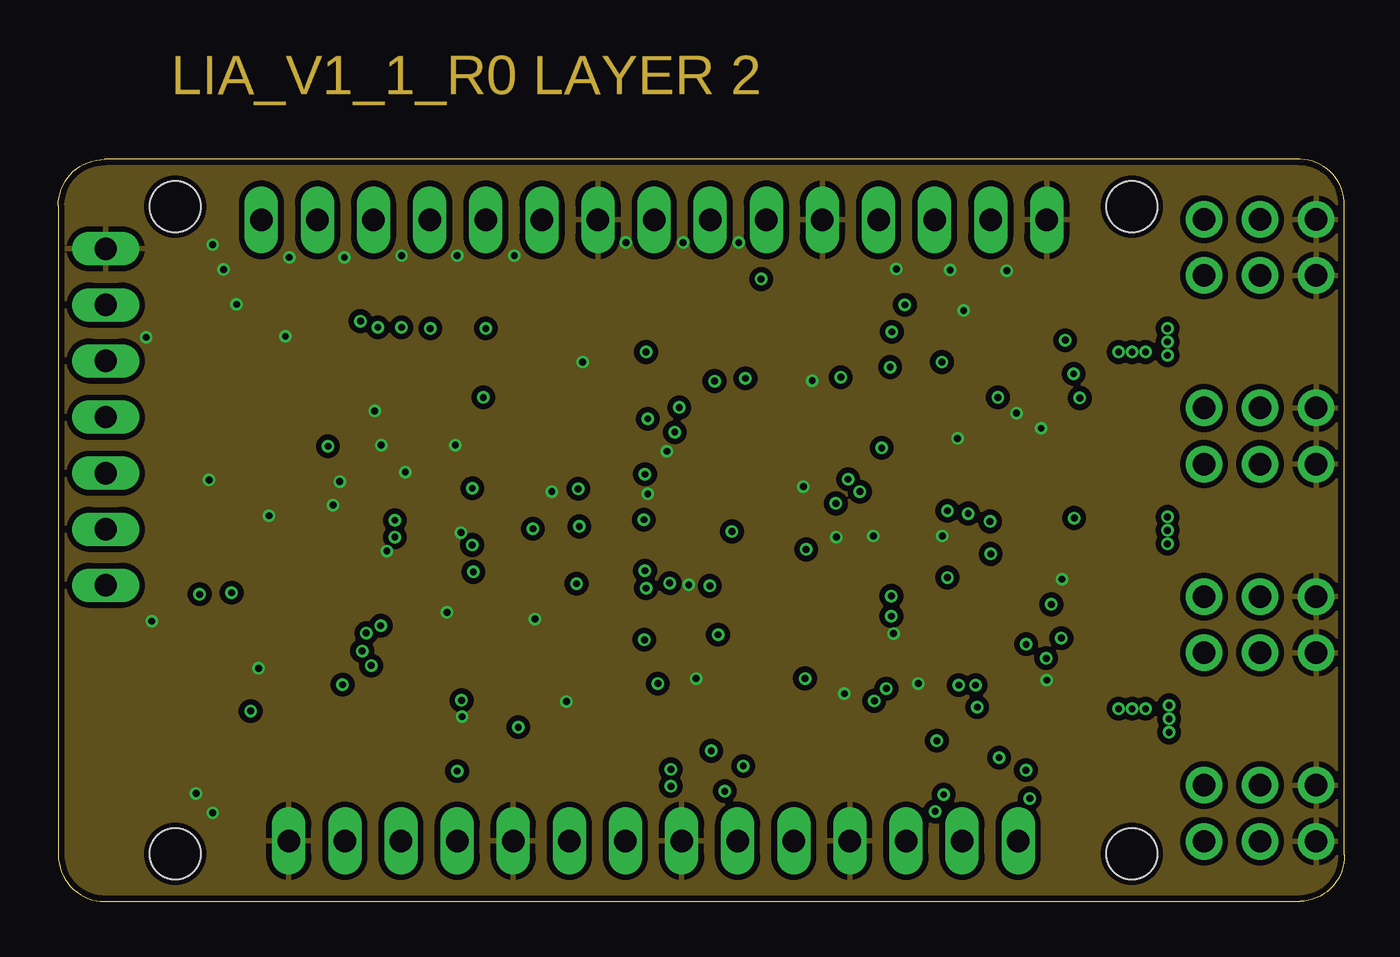
[diagram p4: board, inner layer Route2]
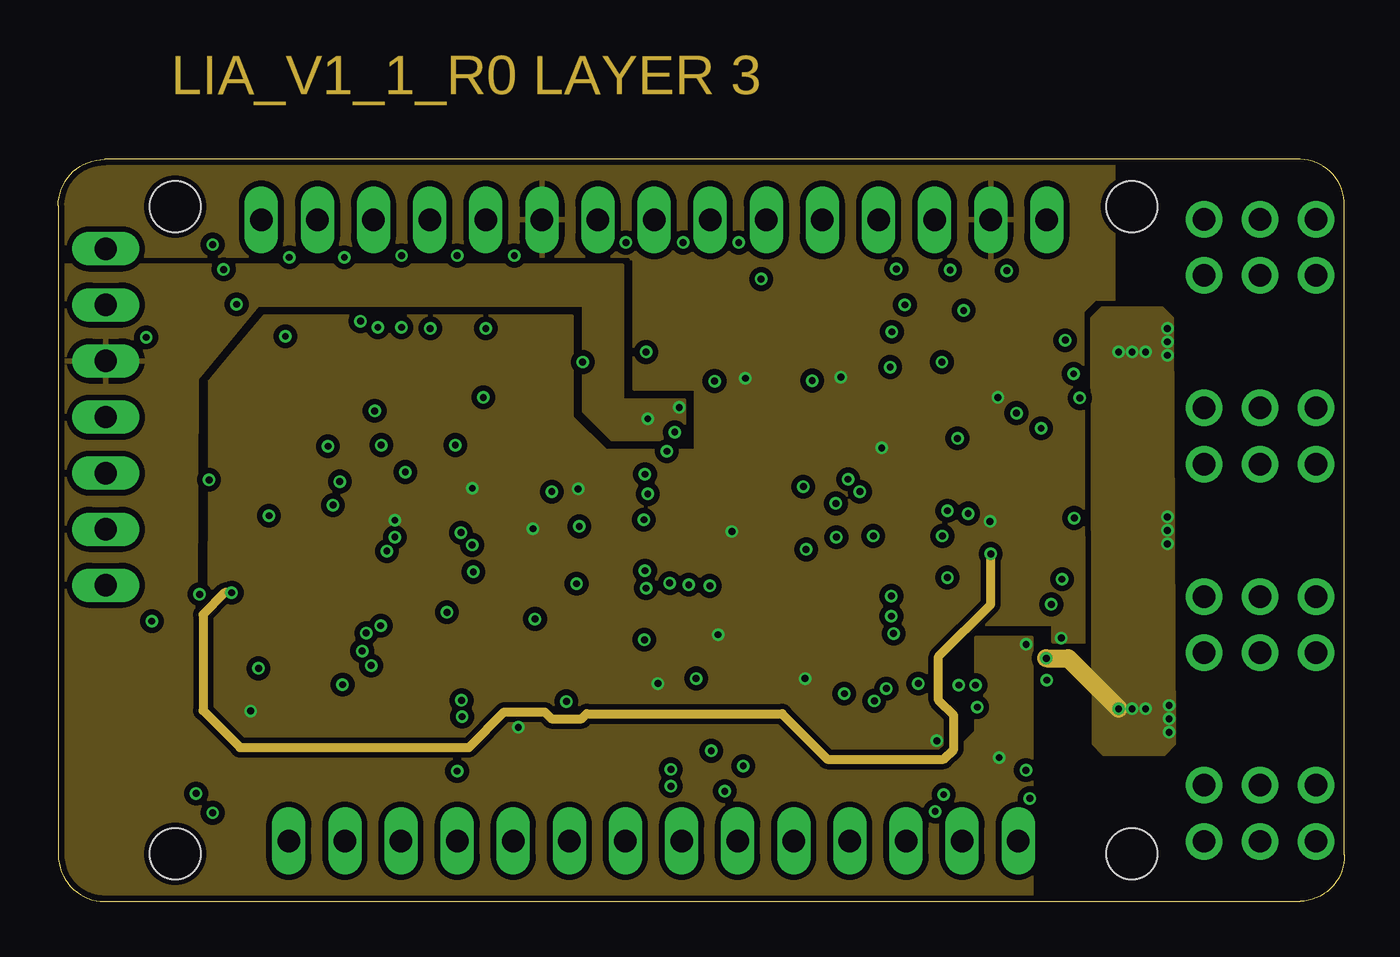
[diagram p5: board, inner layer Route15]
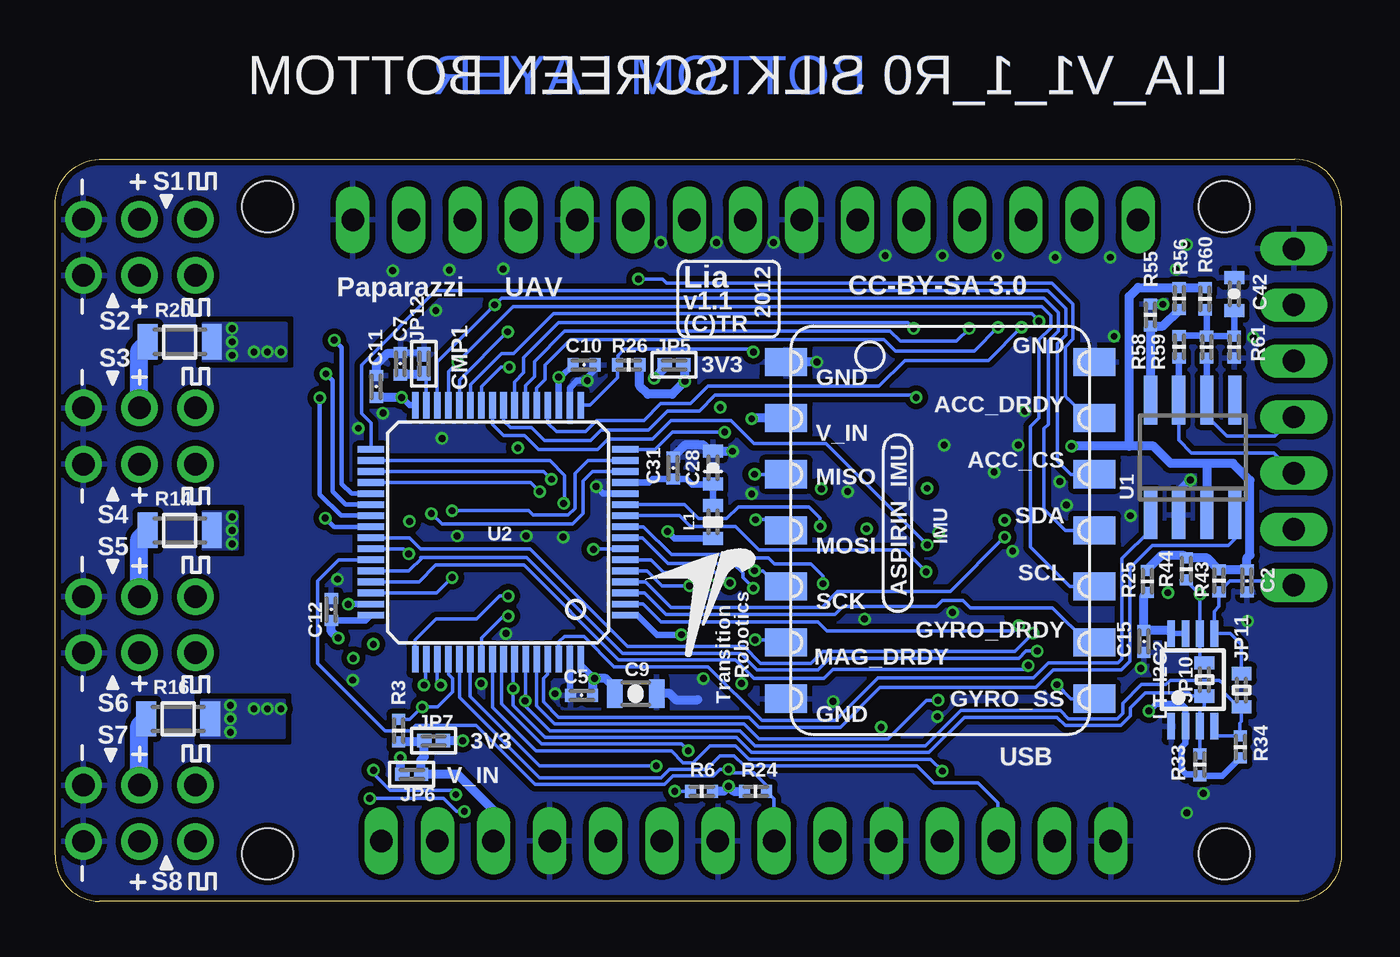
[diagram p6: board, bottom side, seen from below]

Size 58.22 x 33.6 mm. Coordinates in mm from the lower left corner, seen from the top.
Outline: 2.1,0 56.22,0 arc90 58.22,2.1 58.22,31.5 arc90 56.22,33.6 2.1,33.6 arc90 0,31.5 0,2.1 arc90 2.1,0
Copper layers (1*2+15*16): Top 0.035mm / dielectric 0.2mm / Route2 0.035mm / dielectric 1.5mm / Route15 0.035mm / dielectric 0.2mm / Bottom 0.035mm
Design rules: minimum track width 0.15mm, minimum drill 10mil, track to track 0.15mm, track to pad 0.15mm, pad to pad 0.15mm, via to via 0.15mm, smd to smd 0.15mm, copper to edge 10mil, drill to drill 8mil, minimum pad ring 5mil, minimum via ring 5mil, stop-mask expansion 14mil, vias tented up to drill 0.31mm, thermal gap 10mil
Holes 2.3 mm at 5.3,2.15 5.3,31.45 48.6,31.45 48.6,2.15
tKeepout: area 3.3,0.1 to 7.3,4.2; area 46.6,0.1 to 50.6,4.2; area 3.3,29.4 to 7.3,33.5; area 46.6,29.4 to 50.6,33.5
tRestrict: area 44.8,15.2 to 44.9,15.4; area 42.7,15.1 to 42.8,15.5; area 43.5,20.3 to 43.8,20.3; area 34.5,25.2 to 34.6,25.5; area 29.6,16.7 to 29.7,17; area 28.1,16.4 to 28.2,16.6; area 10.6,16.3 to 10.7,16.5; area 16.4,21 to 16.7,21.1; area 43.6,13 to 43.9,13.1; area 39,17.8 to 39.3,17.9; area 26,17.6 to 26.1,17.7; area 9.5,14.2 to 9.6,14.4; 8 more areas
bRestrict: area 5.5,26.9 to 5.7,27; area 11.1,23.5 to 11.3,23.6; area 6.7,16.8 to 6.8,17; area 8,16.8 to 8.1,17; area 8.3,10.4 to 8.4,10.6; area 14.9,12.8 to 15,13; area 30.7,20 to 30.8,20.2; area 33.7,24.7 to 33.9,24.9; area 34.5,9.9 to 34.6,10.1; area 31.6,18.4 to 31.7,18.6; area 31.5,9.3 to 31.6,9.5; area 28.9,19.5 to 29,19.6

### Footprints (pad centres in the part's own frame; a part is rotated, then mirrored left to right if it is on the bottom)
0805-CAP = smd 0.7 x 1.3: P$1 -0.95,0; P$2 0.95,0
0402-CAP = smd 0.5 x 0.6: P$1 -0.5,0; P$2 0.5,0
0603-CAP = smd 0.6 x 0.9: P$1 -0.75,0; P$2 0.75,0
0603-POL-CAP = smd 0.6 x 0.9: + -0.75,0; - 0.75,0
3528/B = smd 1.95 x 2.5: + -1.525,0; - 1.525,0
PB-53398-06 = smd 0.8 x 1.3: 1 -3.125,1.25; 2 -1.875,1.25; 3 -0.625,1.25; 4 0.625,1.25; 5 1.875,1.25; 6 3.125,1.25 | smd 2.1 x 3: PAD1 -5.675,-1.5; PAD2 5.675,-1.5
ZX62-B-5PA = smd 1.8 x 1.9: GND_LEFT -4,0; GND_RIGHT 4,0 | smd 1.9 x 1.9: GND_MID_LEFT -1.2,0; GND_MID_RIGHT 1.2,0 | smd 2.1 x 1.6: GND_UP_LEFT -3.1,2.6; GND_UP_RIGHT 3.1,2.6 | smd 0.4 x 1.35: PIN_1 -1.3,2.725; PIN_2 -0.65,2.725; PIN_3 0,2.725; PIN_4 0.65,2.725; PIN_5 1.3,2.725
MICROMELF-R = smd 0.8 x 1.2: A 0.8,0; C -0.8,0
SOT23-5 = smd 0.55 x 1.2: 1 -0.95,-1.3; 2 0,-1.3; 3 0.95,-1.3; 4 0.95,1.3; 5 -0.95,1.3
ASPIRIN_1 = smd 1.905 x 1.27: P$1 -6.985,7.62; P$2 -6.985,5.08; P$3 -6.985,2.54; P$4 -6.985,0; P$5 -6.985,-2.54; P$6 -6.985,-5.08; P$7 -6.985,-7.62; P$8 6.985,-7.62; P$9 6.985,-5.08; P$10 6.985,-2.54; P$11 6.985,0; P$12 6.985,2.54; P$13 6.985,5.08; P$14 6.985,7.62
SIP1X3_100 = drill 1.016 pad 1.651: 1 2.54,0; 2 0,0; 3 -2.54,0
0402-SQJMP = smd 0.652 x 0.6: P$1 -0.424,0; P$2 0.424,0
0603-RES = smd 0.6 x 0.9: P$1 -0.75,0; P$2 0.75,0
1X04 = drill 1.016 long: 1 -3.81,0; 2 -1.27,0; 3 1.27,0; 4 3.81,0
1X06 = drill 1.016 long: 1 -6.35,0; 2 -3.81,0; 3 -1.27,0; 4 1.27,0; 5 3.81,0; 6 6.35,0
1X07 = drill 1.016 long: 1 -7.62,0; 2 -5.08,0; 3 -2.54,0; 4 0,0; 5 2.54,0; 6 5.08,0; 7 7.62,0
FTSH-105-DV = smd 0.74 x 2.8: 1 -2.54,-2.03; 2 -2.54,2.03; 3 -1.27,-2.03; 4 -1.27,2.03; 5 0,-2.03; 6 0,2.03; 7 1.27,-2.03; 8 1.27,2.03; 9 2.54,-2.03; 10 2.54,2.03
0603-IND = smd 0.6 x 0.9: P$1 -0.75,0; P$2 0.75,0
0402-LED = smd 0.5 x 0.6: A -0.5,0; C 0.5,0
TSSOP_B3 = smd 1.2 x 0.35: 1 -2.925,0.975; 2 -2.925,0.325; 3 -2.925,-0.325; 4 -2.925,-0.975; 5 1.275,-0.975; 6 1.275,-0.325; 7 1.275,0.325; 8 1.275,0.975
ABM8 = smd 1.3 x 1.05: P$1 -1.2,-0.975; P$2 1.2,-0.975; P$3 1.2,0.975; P$4 -1.2,0.975
0402-RES = smd 0.5 x 0.6: P$1 -0.5,0; P$2 0.5,0
1206-RES = smd 0.9 x 1.6: P$1 -1.45,0; P$2 1.45,0
SO-08 = smd 0.6 x 2.2: 1 -1.905,-2.6; 2 -0.635,-2.6; 3 0.635,-2.6; 4 1.905,-2.6; 5 1.905,2.6; 6 0.635,2.6; 7 -0.635,2.6; 8 -1.905,2.6
LQFP64 = smd 1.2 x 0.3: 1 -5.75,3.75; 2 -5.75,3.25; 3 -5.75,2.75; 4 -5.75,2.25; 5 -5.75,1.75; 6 -5.75,1.25; 7 -5.75,0.75; 8 -5.75,0.25; 9 -5.75,-0.25; 10 -5.75,-0.75; 11 -5.75,-1.25; 12 -5.75,-1.75; 13 -5.75,-2.25; 14 -5.75,-2.75; 15 -5.75,-3.25; 16 -5.75,-3.75; 33 5.75,-3.75; 34 5.75,-3.25; 35 5.75,-2.75; 36 5.75,-2.25; 37 5.75,-1.75; 38 5.75,-1.25; 39 5.75,-0.75; 40 5.75,-0.25; 41 5.75,0.25; 42 5.75,0.75; 43 5.75,1.25; 44 5.75,1.75; 45 5.75,2.25; 46 5.75,2.75; 47 5.75,3.25; 48 5.75,3.75 | smd 0.3 x 1.2: 17 -3.75,-5.75; 18 -3.25,-5.75; 19 -2.75,-5.75; 20 -2.25,-5.75; 21 -1.75,-5.75; 22 -1.25,-5.75; 23 -0.75,-5.75; 24 -0.25,-5.75; 25 0.25,-5.75; 26 0.75,-5.75; 27 1.25,-5.75; 28 1.75,-5.75; 29 2.25,-5.75; 30 2.75,-5.75; 31 3.25,-5.75; 32 3.75,-5.75; 49 3.75,5.75; 50 3.25,5.75; 51 2.75,5.75; 52 2.25,5.75; 53 1.75,5.75; 54 1.25,5.75; 55 0.75,5.75; 56 0.25,5.75; 57 -0.25,5.75; 58 -0.75,5.75; 59 -1.25,5.75; 60 -1.75,5.75; 61 -2.25,5.75; 62 -2.75,5.75; 63 -3.25,5.75; 64 -3.75,5.75
SOIC8 = smd 0.6 x 2.2: 1 -1.905,-2.6; 2 -0.635,-2.6; 3 0.635,-2.6; 4 1.905,-2.6; 5 1.905,2.6; 6 0.635,2.6; 7 -0.635,2.6; 8 -1.905,2.6

### Placement (x,y rotation side)
C1  13.05,22.29 90 top
C2  4.27,14.51 270 bottom
C3  9.32,16.57 180 top
C4  28.85,11.34 90 top
C5  34.39,9.33 0 bottom
C6  28.45,17.15 0 top
C7  42.6,24.34 270 bottom
C9  31.95,9.41 0 bottom
C10  34.28,24.29 180 bottom
C11  43.69,23.31 270 bottom
C12  45.72,13.22 270 bottom
C13  14.95,18.93 90 top
C14  44.12,13.22 90 top
C15  8.93,11.77 270 bottom
C26  14.8,22.21 90 top
C27  33.99,16.77 180 top
C28  28.44,19.64 90 bottom
C31  30.25,19.62 270 bottom
C35  44.29,20.23 90 top
C36  40.94,22.82 180 top
C37  40.71,20.38 180 top
C38  45.57,16.19 270 top
C39  40.79,12.68 180 top
C42  4.85,27.5 270 bottom
CON_ANALOG1  23.79,16.8 270 top
CON_ANALOG2  18.61,16.8 270 top
CON_USB_MICRO  1.62,8 270 top
D3  9.11,14.31 270 top
IC9  12.21,19.01 270 top
IMU  18.16,16.8 0 bottom
J1  54.41,30.88 0 top
J2  54.41,28.34 0 top
J3  54.41,22.34 0 top
J4  54.41,19.8 0 top
J5  54.41,13.8 0 top
J6  54.41,11.26 0 top
J7  54.41,5.26 0 top
J8  54.41,2.72 0 top
JP1  43.59,10.47 180 top
JP2  9.85,23.73 90 top
JP3  11.07,21.14 0 top
JP4  28.85,22.76 90 top
JP5  30.21,24.29 0 bottom
JP6  42.08,5.75 0 bottom
JP7  41.09,7.27 180 bottom
JP8  25.07,10.55 270 top
JP9  26.29,10.55 270 top
JP10  6.19,10.04 90 bottom
JP11  4.52,9.56 90 bottom
JP12  41.53,24.34 90 bottom
JP13  45.72,13.22 270 top
JP14  40.94,30.86 180 top
JP15  14.25,2.74 0 top
JP16  30.78,30.86 180 top
JP17  39.65,2.74 0 top
JP20  26.95,2.74 0 top
JP21  2.15,21.93 270 top
JP22  16.81,30.86 180 top
JTAG  33.83,12.91 270 top
L1  28.44,17.18 90 bottom
LED1  12.5,11.92 0 top
LED2  12.8,13.07 0 top
LED3  13.72,14.21 0 top
LED4  13.72,15.35 0 top
LED5  13.72,16.49 0 top
LED6  23.42,16.19 0 top
LED7  23.42,15.07 0 top
LED8  23.42,13.68 0 top
LEDVIN  20.15,8.87 270 top
LT_I2C2  6.72,10.86 90 bottom
Q1  28.52,14.36 270 top
R3  42.67,7.73 90 bottom
R4  36.62,21.78 90 top
R5  36.37,24.09 270 top
R6  28.96,4.99 180 bottom
R7  31.78,16.77 180 top
R8  10.82,13.07 180 top
R9  48.6,27.26 270 top
R10  10.52,11.92 180 top
R11  52.58,25.33 180 top
R12  11.66,16.49 180 top
R13  52.58,16.8 180 top
R14  52.58,16.8 0 bottom
R15  52.65,8.26 180 top
R16  52.65,8.26 0 bottom
R17  11.14,23.73 270 top
R18  11.07,22.21 0 top
R19  48.6,6.33 90 top
R20  52.58,25.33 0 bottom
R23  21.49,8.87 270 top
R24  26.52,4.99 0 bottom
R25  8.78,14.49 90 bottom
R26  32.26,24.29 180 bottom
R27  45.62,19.39 270 top
R28  45.11,9.28 180 top
R29  27.63,11.01 90 top
R30  19.05,8.87 90 top
R31  45.95,7.58 180 top
R32  21.49,16.19 180 top
R33  6.4,6.19 270 bottom
R34  4.57,6.99 270 bottom
R35  21.49,15.07 180 top
R36  21.49,13.68 180 top
R37  11.66,15.35 180 top
R38  11.66,14.21 180 top
R39  45.95,6.51 180 top
R40  45.95,5.37 180 top
R41  44.65,24.42 180 top
R42  44.65,23.35 180 top
R43  5.54,14.51 90 bottom
R44  7.01,15.05 90 bottom
R45  44.65,22.29 180 top
R55  8.64,26.55 270 bottom
R56  7.34,27.3 90 bottom
R58  7.34,25.11 90 bottom
R59  6.1,25.1 270 bottom
R60  6.17,27.28 270 bottom
R61  4.85,25.1 270 bottom
U1  6.72,20.1 0 bottom
U2  38.17,16.71 180 bottom
U$1  29.02,13.51 0 bottom
VREG1  41.17,16.57 90 top

### Tracks (layer width: path | path; a pad name or v marks a point on that pad's centre or on a via)
+3V3  (via drill 0.31)
  Top 0.152: 30.91,15.45 JTAG.1
  Top 0.305: v30.5,16.75 30.5,15.87 30.91,15.45
  Top 0.406: CON_ANALOG2.2 18.77,18.67 v18.75,18.7 | CON_ANALOG1.2 v23.54,18.67 v23.54,18.68 | R5.P$1 36.28,24.59 v35.43,23.73 | R4.P$1 37.1,21.28 37.26,21.12 37.26,20.55 v37.28,20.53 | R7.P$2 30.52,16.77 v30.5,16.75 | v42.18,17.21 VREG1.3 | 42.14,17.26 42.14,20.38 | v27.15,9.87 27.15,10.02 R29.P$1 27.13,10.5 26.65,10.97 JP9.P$1 | R10.P$2 10.02,12.76 R8.P$2 10.32,13.37 R38.P$2 R37.P$2 R12.P$2 11.16,16.83 11.58,17.26 v15.24,17.26 | R36.P$2 R35.P$2 R32.P$2 20.99,16.38 v21.49,16.88 | JP15.2 12.98,4.35 v8.71,8.62
  Top 0.61: v42.54,22.82 C36.P$1 41.69,20.6 41.62,20.53 41.62,20.46 41.7,20.38 42.14,20.38 C37.+ 42.23,19.69
  Bottom 0.305: 43.87,12.96 U2.48 44.17,12.72 C12.P$2 | L1.P$1 30.18,16.43 v30.5,16.75 | v8.71,8.62 8.38,8.95 7.24,8.95 7.05,8.76 LT_I2C2.2 7.05,7.16 7.24,6.97 7.24,5.98 7.01,5.75 6.46,5.75 R33.P$2 6.39,5.67 5.39,5.67 R34.P$2 | C10.P$2 35.34,23.73 v35.43,23.73 v35.42,23.74 U2.19 | U2.32 42.18,22.46 v42.54,22.82 42.55,22.81 | C9.P$1 32.9,9.69 | U2.1 31.88,12.96 30.99,12.07 v29.87,12.07 | U2.64 34.42,10.71 v33.81,10.09
  Bottom 0.406: 42.55,22.81 C11.P$2 | 32.9,9.69 33.3,10.09 v33.81,10.09 33.89,10.02 C5.P$2 | v39.78,7.27 JP7.P$1 | JP5.P$1 30.63,24.16 v31.11,23.68 | C12.P$2 45.72,12.23 v45.41,11.92
  pour Route15 (isolate 0.254, rank 2): 19.58,7.4 8.41,7.45 6.83,9.03 6.85,23.58 9.32,26.5 23.27,26.5 23.27,21.93 24.79,20.41 28.85,20.41 28.85,23.2 26.06,23.2 26.06,29.11 0.3,29.11 0.3,33.6 47.8,33.6 47.8,28.38 47.72,11.74 45.03,11.74 45.03,12.53 41.09,12.51 41.09,7.91 40.02,6.94 34.72,6.94 32.66,8.98 28.35,8.98 26.57,7.2 25.04,7.2 23.39,8.85 20.98,8.85
+5V  (via drill 0.31)
  Top 0.406: CON_ANALOG1.3 24.11,17.42 23.9,17.64 21.23,17.64 21.03,17.43 21.03,17.42 CON_ANALOG2.3 18.5,17.42 17.91,18.02 17.91,19.39 16.76,20.53 15.73,20.53 C26.P$1 14.06,21.46 13.93,21.34 C1.P$1 12.94,21.34 v12.21,20.61 | JP3.P$2 11.68,21.14 v12.21,20.61 | IC9.5 12.86,19.96 v12.21,20.61
  Bottom 0.406: 9.6,20.61 8.5,20.61 7.72,19.83 6.09,19.83 | 9.6,20.61 v12.21,20.61 | 6.09,19.83 U1.3 | R60.P$1 7.33,27.78 R56.P$2 9.2,27.8 9.6,27.39 9.6,20.61 | 6.09,19.83 4.91,19.83 4.14,19.06 4.14,15.68 4.27,15.55 C2.P$1 R43.P$2 6.07,15.55 R44.P$2 7.12,15.66 8.15,15.66 8.78,15.03 R25.P$2
ADC_1  (via drill 0.31)
  Top 0.152: 25.06,16.19 CON_ANALOG1.4 23.93,16.17 LED6.C 23.59,16.52 v23.59,16.98
  Bottom 0.152: U2.11 29.73,17.96 29.1,17.33 27.83,17.33 27.3,17.87 24.1,17.87 23.59,17.36 v23.59,16.98
ADC_2  (via drill 0.31)
  Top 0.152: v26.61,14.18 26.06,14.18 25.32,14.92 CON_ANALOG1.5 24.07,14.92 LED7.C
  Bottom 0.152: U2.8 31.64,16.46 30.47,15.3 27.53,15.3 27.1,14.87 27.1,14.67 v26.61,14.18
ADC_3  (via drill 0.31)
  Top 0.152: 25.07,13.65 CON_ANALOG1.6 LED8.C 23.46,14.13 v23.46,14.39
  Bottom 0.152: U2.9 31.58,16.96 30.32,15.71 27.05,15.71 26.9,15.55 25.93,15.55 25.65,15.28 24,15.28 23.47,14.74 v23.47,14.39 v23.46,14.39
ADC_4  (via drill 0.31)
  Top 0.152: 19.88,16.19 CON_ANALOG2.4 18.77,16.17 v18.74,16.14 17.88,15.28 14.29,15.28 LED4.C
  Bottom 0.152: U2.25 38.42,21.6 37.92,21.09 36.98,21.09 36.35,20.46 33.68,20.46 33.2,20.94 31.19,20.94 30.35,21.78 27.63,21.78 26.59,20.74 23.34,20.74 v18.74,16.14
ADC_6  (via drill 0.31)
  Top 0.152: CON_ANALOG2.5 v18.8,14.92 v18.79,14.92 18.08,14.21 LED3.C
  Bottom 0.152: U2.10 29.95,17.46 29.46,16.98 27.43,16.98 26.36,15.91 19.78,15.91 v18.79,14.92
BARO_DRDY  (via drill 0.31)
  Bottom 0.152: U2.26 38.92,23.31 38.04,24.19 v37.66,24.19
BOOT0  (via drill 0.31)
  Top 0.152: CON_ANALOG2.6 | CON_ANALOG2.6 19.05,12.86 R30.P$2 18.53,9.37 v18.26,9.1
  Bottom 0.152: U2.60 36.42,8.86 35.6,8.04 27.05,8.04 26.36,7.35 20.52,7.35 18.77,9.1 v18.26,9.1
CAN_CENTER
  Bottom 0.305: R58.P$2 6.11,25.61 R59.P$1 | R59.P$1 6.1,26.71 R60.P$2 | R59.P$1 R61.P$1 C42.P$2
CAN_H
  Bottom 0.152: U1.7 7.36,20.88 6.78,20.3 3.06,20.3 JP21.5
  Bottom 0.305: U1.7 7.36,24.59 R58.P$1
CAN_L
  Bottom 0.152: JP21.4 3.01,21.07 5.18,21.07 6.09,21.98 U1.6
  Bottom 0.305: U1.6 R59.P$2
CAN_RX
  Bottom 0.152: U1.4 4.82,16.42 5.12,16.11 8.55,16.11 9.57,15.09 9.57,10.86 9.96,10.47 13.03,10.47 13.82,9.69 20.88,9.69 22.68,7.88 26.36,7.88 26.82,8.34 35.43,8.34 36.12,9.03 36.12,10.09 35.92,10.29 U2.61
CAN_TX
  Bottom 0.152: U2.62 35.42,11.75 35.17,12 34.29,12 32.92,10.63 28.67,10.63 26.23,8.19 22.91,8.19 20.97,10.12 13.94,10.12 13.26,10.8 10.11,10.8 9.93,10.99 9.93,15.52 8.63,16.82 U1.1
EXTSPI_DRDY  (via drill 0.31)
  Top 0.152: v13.69,26.27 12.32,26.27 9.22,29.37 9.22,30.84 JP22.7
  Bottom 0.152: U2.27 39.42,23.4 38.02,24.8 37.47,24.8 35.66,26.6 14.02,26.6 v13.69,26.27
EXTSPI_MISO  (via drill 0.31)
  Top 0.152: v16.84,25.94 16.84,30.84 JP22.4
  Bottom 0.152: U2.22 36.92,23.36 36.52,23.76 36.52,24.45 35.15,25.82 20.42,25.82 19.96,25.36 17.42,25.36 v16.84,25.94
EXTSPI_MOSI  (via drill 0.31)
  Top 0.152: v19.35,25.94 JP22.3
  Bottom 0.152: U2.23 37.42,23.52 37.01,23.94 37.01,24.62 35.43,26.2 19.61,26.2 v19.35,25.94
EXTSPI_SCK  (via drill 0.31)
  Top 0.152: v15.54,25.99 15.54,27.47 14.32,28.69 14.32,30.81 JP22.5
  Bottom 0.152: U2.21 36.42,23.25 36.04,23.63 36.04,24.29 34.9,25.43 20.7,25.43 20.19,24.93 16.61,24.93 v15.54,25.99
EXTSPI_SS  (via drill 0.31)
  Top 0.152: v14.47,25.99 14.47,26.64 11.73,29.37 JP22.6
  Bottom 0.152: U2.20 35.92,21.66 35.53,21.27 34.21,21.27 33.7,21.78 31.57,21.78 30.81,22.54 29.46,22.54 28.68,23.33 20.93,23.33 19.76,24.5 15.97,24.5 v14.47,25.99
GND  (via drill 0.31)
  Top 0.305: CON_ANALOG1.1 25.01,19.92 | 39.09,20.66 39.12,20.64 39.12,20.89
  Top 0.406: 38.57,13.99 39.22,13.33 38.04,12.15 37.8,12.15 | IC9.2 v12.74,19.01 | C1.P$2 12.6,23.24 R18.P$2 | C35.P$2 44.29,21.22 v44.49,21.42 | C27.P$1 34.95,16.77 v35.23,16.49 | 28.83,10.81 C4.P$1 28.86,10.83 | v28.54,14.34 28.54,16.44 28.93,16.82 28.93,17.13 C6.P$2 28.96,16.85 29.49,16.32 29.49,15.61 29.51,15.58
  Top 0.61: VREG1.7 VREG1.6 | 38.57,13.99 VREG1.8 | 39.22,13.33 39.87,12.68 | 38.88,20.53 38.57,20.22 VREG1.5 38.58,18.47 38.58,17.18 | C36.P$2 39.98,22.82 39.12,21.95 39.12,20.45 C37.-
  Bottom 0.305: U1.2 7.36,16.67 | U2.12 33.41,18.46 v33.73,18.78 | U2.18 34.92,23.25 34.59,23.57 34.59,23.58 v34.13,23.58 34.13,23.74 33.78,24.09 C10.P$1 | C7.P$1 41.65,24.84 41.53,24.72 | U2.63 34.92,9.37 C5.P$1
  Bottom 0.406: v27.55,20.38 27.57,20.39 C28.- 28.61,20.39 28.91,20.68 29.68,20.68 C31.P$1 | U1.2 7.36,18.55 v6.83,19.09 | C9.P$2 30.4,9.41 30.12,9.13 29.13,9.13 | C11.P$1 43.69,24.32 43.2,24.8 42.64,24.8 C7.P$1 | v8.08,27.04 8.59,27.04 8.61,27.01 | v23.74,24.42 25.22,24.42
  other vias: 10.28,25.59 3.98,25.54 23.01,9.05 14.33,22.21 12.44,17.94 42.95,28.56 10.46,29.16 12.95,29.16 15.54,29.24 20.65,29.24 18.06,29.24 25.7,29.83 28.29,29.83 30.8,29.83 17.6,13.09 40.02,16.55 7.49,28.61 9.54,17.46 6.24,4.89 15.72,19.44 26.69,18.45 38.94,9.87 17.98,20.66 22.35,18.55 18.28,8.37 37.94,28.64 40.38,28.58 21.58,12.79 6.99,4.01 6.99,29.74 35.59,9.41 28.88,10.09 40.99,26.76 37.81,12.13 45.44,14.59 44.75,10.02 9.07,10.55 18.23,16.7 14.88,15.86 14.62,20.66 40.71,20.96 36.9,16.55 43.38,22.11 4.24,12.68
  pour Route2 (isolate 0.254): 0,0 0,33.6 58.22,33.6 58.22,0
  pour Bottom (isolate 0.254, rank 2): 0,0 0,33.6 58.22,33.6 58.22,0
  pour Top (isolate 0.254, rank 2): 0,33.6 58.22,33.6 58.22,0 0,0
I2C2_SCL  (via drill 0.31)
  Top 0.152: R4.P$2 37.94,22.28 40.01,24.34 v40.01,24.42 40.77,25.18 40.77,25.94 39.67,27.04 JP14.3
  Bottom 0.152: IMU.P$10 12.29,14.26 14.07,16.04 14.07,21.5 13.69,21.88 13.69,25.43 13.16,25.97 13.16,26.53 13.56,26.93 37.49,26.93 v40.01,24.42 40.42,24 U2.29
I2C2_SDA  (via drill 0.31)
  Top 0.152: R5.P$2 37.88,23.59 38.33,24.04 v38.33,27.01 37.13,28.2 JP14.4
  Bottom 0.152: IMU.P$11 12.49,16.8 13.46,17.76 13.46,21.4 13.26,21.6 13.26,25.36 12.8,25.82 12.8,26.65 13.46,27.32 38.02,27.32 v38.33,27.01 40.92,24.41 U2.30
IMU_ACC_CS
  Bottom 0.152: IMU.P$12 12.24,19.34 12.85,19.95 12.85,25.26 12.47,25.64 12.47,26.83 13.28,27.64 40.99,27.64 44.35,24.29 44.35,22.09 43.92,21.66 U2.33
IMU_ACC_DRDY  (via drill 0.31)
  Top 0.152: v37.74,25.79 34.21,25.79 v31.82,28.18
  Bottom 0.152: IMU.P$13 11.5,21.88 12.36,22.74 12.37,22.74 12.5,22.87 12.5,25.11 12.14,25.46 12.14,27.04 13.11,28 30.56,28 30.73,28.18 v31.82,28.18 | U2.28 39.92,23.61 v37.74,25.79
IMU_GYRO_DRDY
  Bottom 0.152: U2.3 31.55,13.96 30.58,12.99 22.91,12.99 22.55,13.35 18.34,13.35 18.06,13.62 17.12,13.62 16.79,13.29 13.08,13.29 11.51,11.72 IMU.P$9
IMU_GYRO_SS  (via drill 0.31)
  Top 0.152: v12.87,9.81 14.1,9.81 14.71,10.42 14.71,11.01 14.6,11.12 v14.6,12.48
  Bottom 0.152: U2.2 31.61,13.46 30.8,12.66 23.7,12.66 23.29,12.25 14.83,12.25 v14.6,12.48 | IMU.P$8 12.24,9.18 v12.87,9.81
IMU_MAG_DRDY  (via drill 0.31)
  Top 0.152: v26.54,11.85 27.3,11.85 R29.P$2 27.77,11.51 27.94,11.34 29.31,11.34 29.72,10.93 29.72,6.97 v29.57,6.82
  Bottom 0.152: IMU.P$6 25.45,11.72 25.58,11.85 v26.54,11.85 | U2.57 38.02,10.86 38.02,8.95 36.2,7.12 29.87,7.12 v29.57,6.82
IMU_SPI_MISO  (via drill 0.31)
  Top 0.152: v26.56,19.34 26.9,19.34 27.53,18.7 31.49,18.7 32.1,18.09 33.88,18.09 34.89,19.11 v35.76,19.11
  Bottom 0.152: IMU.P$3 v26.56,19.34 | U2.35 36.11,19.46 v35.76,19.11
IMU_SPI_MOSI  (via drill 0.31)
  Top 0.152: v36.29,18.55 34.92,18.55 34.13,17.76 31.82,17.76 31.31,18.27 27.5,18.27 v26.51,17.28
  Bottom 0.152: U2.36 36.7,18.96 v36.29,18.55 | v26.51,17.28 25.62,17.28 IMU.P$4
IMU_SPI_SCK  (via drill 0.31)
  Top 0.152: v26.56,14.97 26.56,16.47 27.15,17.05 27.15,17.41 27.58,17.84 31.06,17.84 31.46,17.43 34.62,17.43 v35.2,18.02
  Bottom 0.152: IMU.P$5 25.14,14.23 25.45,14.23 26.19,14.97 v26.56,14.97 | U2.34 35.82,19.96 35.15,19.29 35.15,18.07 v35.2,18.02
JTAG_RST  (via drill 0.31)
  Top 0.152: JTAG.10 34.37,10.37 33.86,10.88 v33.86,15.94 33.49,16.3 C27.P$2 R7.P$1
  Bottom 0.152: v33.86,15.94 33.83,15.96 U2.7
JTAG_TCK  (via drill 0.31)
  Top 0.152: v37.72,13.83 37.34,13.83 36.98,14.18 JTAG.4
  Bottom 0.152: U2.49 41.92,11.83 40.97,12.79 39.14,12.79 38.1,13.83 v37.72,13.83
JTAG_TDI  (via drill 0.31)
  Top 0.152: JTAG.8 37.47,11.64 38.1,11.01 40.31,11.01 v41.53,9.79
  Bottom 0.152: v41.53,9.79 41.45,9.87 41.45,10.94 U2.50
JTAG_TDO  (via drill 0.31)
  Top 0.152: v37.72,12.91 JTAG.6
  Bottom 0.152: U2.55 38.92,11.94 37.95,12.91 v37.72,12.91
JTAG_TMS  (via drill 0.31)
  Top 0.152: 35.86,15.46 JTAG.2 36.03,15.28 39.85,15.28 40.25,14.87 v40.25,14.67
  Bottom 0.152: U2.46 40.95,13.96 v40.25,14.67
JTAG_TRST  (via drill 0.31)
  Top 0.152: LED2.C 14.86,13.06 15.16,12.76 15.16,10.02 16.35,8.83 16.35,7.61 v18.06,5.9 JP15.4
  Bottom 0.152: v18.06,5.9 18.59,6.44 26.82,6.44 27.43,7.05 28.57,7.05 29.34,6.28 29.79,6.28 30.33,6.82 36.45,6.82 38.42,8.79 U2.56
LED1  (via drill 0.31)
  Top 0.152: LED1.C 13.22,12.15 v13.94,12.15
  Bottom 0.152: U2.41 42.18,16.46 41.68,15.96 36.73,15.96 32.31,11.54 27.05,11.54 26.29,10.78 24,10.78 23.47,11.31 14.78,11.31 v13.94,12.15
LED2  (via drill 0.31)
  Top 0.152: LED5.C v15.24,16.49
  Bottom 0.152: U2.4 31.49,14.46 30.35,13.32 23.52,13.32 22.81,14.03 17.7,14.03 v15.24,16.49
LT_I2C1_SCL  (via drill 0.31)
  Top 0.152: v6.4,13.9 3.45,16.85 JP21.6
  Bottom 0.152: JP10.P$2 6.4,11 LT_I2C2.6 v6.4,13.9 7.01,14.51 R44.P$1 7.27,14.55
LT_I2C1_SDA
  Bottom 0.152: JP11.P$2 4.51,11.61 5.03,12.13 LT_I2C2.5 5.75,13.13 5.54,13.35 R43.P$1 5.04,14.51 2.35,14.51 JP21.7
N$1
  Bottom 0.406: U1.8 R55.P$2 8.07,26.05 7.34,26.78 R56.P$1
N$2
  Bottom 0.813: R14.P$1 54.41,16.42 J5.2
N$3
  Top 0.813: R15.P$1 54.41,8.57 J6.2
N$4
  Top 0.406: LED1.A R10.P$1
N$5
  Top 0.152: R32.P$1 LED6.A
N$6
  Top 0.406: IC9.4 14.58,18.06 C13.P$1
N$7
  Top 0.406: C35.P$1 44.29,18.58 44.3,18.58 43.87,18.58 VREG1.4
N$8
  Bottom 0.254: LT_I2C2.7 LT_I2C2.8
  Bottom 0.406: R25.P$1 8.94,13.84 C15.P$1 7.84,12.27 LT_I2C2.8
N$9
  Top 0.152: R35.P$1 LED7.A
N$10
  Top 0.406: LED2.A R8.P$1
N$11
  Top 0.152: R36.P$1 LED8.A
N$12
  Top 0.406: LEDVIN.A R23.P$1
N$13
  Top 0.406: R12.P$1 LED5.A
N$14
  Top 0.406: R37.P$1 LED4.A
N$15
  Top 0.406: R38.P$1 LED3.A
N$16
  Bottom 0.813: R16.P$1 54.41,7.96 J7.2
N$17
  Top 0.406: J8.2 53.13,4 50.6,4 49.71,4.88 R19.P$1
N$18
  Top 0.813: R13.P$1 54.41,17.18 J4.2
N$19
  Bottom 0.813: R20.P$1 54.41,24.95 J3.2
N$20
  Top 0.813: R11.P$1 54.41,25.72 J2.2
N$21
  Top 0.406: J1.2 53.13,29.6 50.6,29.6 49.71,28.71 R9.P$1
OSC_IN  (via drill 0.31)
  Top 0.152: v29.5,14.29 v29.49,14.28 Q1.P$3 29.49,13.02 28.85,12.38 C4.P$2
  Bottom 0.152: U2.5 31.43,14.96 30.75,14.29 v29.5,14.29
OSC_OUT  (via drill 0.31)
  Top 0.152: v27.68,14.41 27.54,14.55 Q1.P$1 27.54,16.75 C6.P$1
  Bottom 0.152: U2.6 31.25,15.46 30.68,14.89 28.16,14.89 v27.68,14.41
PC12
  Bottom 0.152: U2.53 39.92,9.23 36.29,5.6 30.78,5.6 30.4,5.98 28.73,5.98 28.12,6.59 27.48,6.59 27.02,6.13 19.2,6.13 18.44,5.37 16.46,5.37 15.54,4.46 15.54,2.77 JP15.3
S1
  Top 0.152: R41.P$1 45.49,24.42 46.71,25.64 46.71,28.99 47.4,29.68 49.53,29.68 50.75,30.9 51.85,30.9 J1.3
S2
  Top 0.152: R42.P$1 46.41,23.35 47.09,24.04 47.09,26.63 47.7,27.24 50.77,27.24 J2.3
S3
  Top 0.152: J3.3 51.74,22.21 45.23,22.21 R45.P$1
S4
  Top 0.152: R27.P$1 51.78,19.89 J4.3
S5
  Top 0.152: R28.P$1 50.13,13.8 J5.3
S6
  Top 0.152: J6.3 49.17,11.26 46.45,8.54 R31.P$1
S7
  Top 0.152: R39.P$1 50.62,6.51 J7.3
S8
  Top 0.152: R40.P$1 47.9,3.92 49.45,3.92 50.66,2.72 J8.3
SERVO_1  (via drill 0.31)
  Top 0.152: R41.P$2 45.14,25.41 v45.59,25.41
  Bottom 0.203: v45.59,25.41 45.26,25.08 45.26,18.91 44.81,18.46 U2.37
SERVO_2  (via drill 0.31)
  Top 0.152: R42.P$2 44.69,23.89 v45.97,23.89
  Bottom 0.203: U2.38 45.08,17.96 45.66,18.55 45.66,23.58 v45.97,23.89
SERVO_3  (via drill 0.31)
  Top 0.152: R45.P$2 44.15,22.32 44.65,22.82 46.22,22.82 v46.25,22.79
  Bottom 0.203: U2.39 45.29,17.46 46.25,18.43 v46.25,22.79
SERVO_4  (via drill 0.31)
  Top 0.152: R27.P$2 45.62,17.73 v45.99,17.36
  Bottom 0.203: U2.40 45.6,16.96 v45.99,17.36
SERVO_5  (via drill 0.31)
  Top 0.152: v41.19,17.56 41.19,17.21 41.68,16.72 41.68,14.74 40.84,13.9 40.84,11.54 41.68,10.7 41.91,10.7 42.75,9.87 43.51,9.87 44.09,9.28 R28.P$2
  Bottom 0.152: U2.14 33.89,19.46 34.31,19.03 34.31,17.56 34.79,17.08 40.71,17.08 v41.19,17.56
SERVO_6  (via drill 0.31)
  Top 0.152: v40.25,17.69 41.38,16.57 41.38,14.89 40.54,14.06 40.54,11.39 41.53,10.4 41.76,10.4 44.58,7.58 R31.P$2
  Bottom 0.152: v40.25,17.69 36.8,17.69 36.59,17.48 34.99,17.48 34.69,17.79 34.69,19.36 34.09,19.96 U2.15
SERVO_7/I2C1_SCL  (via drill 0.31)
  Top 0.152: v40.08,4.84 37.49,7.43 v37.49,9.64 | v43.81,5.94 44.38,6.51 R39.P$2
  Bottom 0.152: R33.P$1 LT_I2C2.3 6.4,8.63 6.2,8.82 6.2,9.28 JP10.P$1 6.21,9.31 6.78,9.31 6.91,9.43 8.86,9.43 9.54,8.75 9.54,8.4 9.98,7.96 12.5,7.96 12.88,8.34 17.07,8.34 18.67,6.74 26.7,6.74 27.38,7.43 36.04,7.43 37.49,8.87 v37.49,9.64 37.49,10.9 U2.58 | R33.P$1 | v43.81,5.94 43.81,5.79 43.05,5.03 40.27,5.03 v40.08,4.84
SERVO_8/I2C1_SDA  (via drill 0.31)
  Top 0.152: v39.7,4.07 36.94,6.83 v36.94,9.08 | v43.98,4.66 44.69,5.37 R40.P$2
  Bottom 0.152: LT_I2C2.4 5.75,7.59 5.66,7.5 4.58,7.5 R34.P$1 4.6,7.51 4.6,8.06 4.51,8.14 JP11.P$1 4.66,8.81 5.31,9.46 5.31,9.81 5.51,10.02 7.74,10.02 7.94,9.81 9.04,9.81 9.88,8.98 9.88,8.52 10.13,8.27 12.34,8.27 12.72,8.65 17.22,8.65 18.82,7.05 26.54,7.05 27.23,7.73 35.81,7.73 36.94,8.86 v36.94,9.08 36.92,9.1 U2.59 | v43.98,4.66 40.63,4.66 40.04,4.07 v39.7,4.07
SERVO_BUS  (via drill 0.31)
  Top 0.406: JP1.P$1 44.54,11.01 v44.73,11.01
  Route15 0.813: v48.01,8.72 45.72,11.01 v44.73,11.01
  other vias: 50.22,16.8 50.22,17.41 50.22,16.19 50.22,25.33 50.22,25.94 50.22,24.72 48.62,24.88 49.22,24.88 48.01,24.88 50.29,8.87 50.29,8.26 50.29,7.66 48.62,8.72 49.22,8.72
  pour Route15 (isolate 0.254): 47.24,26.86 49.99,26.86 50.44,26.4 50.52,7.12 50.06,6.66 47.32,6.66 46.86,7.12 46.79,26.4
  pour Top (no thermals): 49.99,17.64 51.51,17.64 51.51,15.96 49.99,15.96
  pour Bottom (no thermals): 49.99,17.64 51.51,17.64 51.51,15.96 49.99,15.96
  pour Top (no thermals): 47.78,26.17 51.51,26.17 51.51,24.5 47.78,24.5
  pour Top (no thermals): 47.85,9.1 51.59,9.1 51.59,7.43 47.85,7.43
  pour Bottom (no thermals): 47.85,9.1 51.59,9.1 51.59,7.43 47.85,7.43
  pour Bottom (no thermals): 47.78,26.17 51.51,26.17 51.51,24.5 47.78,24.5
U1_U5_POW  (via drill 0.31)
  Top 0.406: JP8.P$2 JP9.P$2 26.29,6.21 | JP20.2 23.14,3.06 26.29,6.21 | JP20.5 30.76,3.27 28.82,5.22 v27.74,5.22 27.28,5.22 26.29,6.21
  Bottom 0.406: R6.P$1 27.96,4.99 v27.74,5.22 27.51,4.99 R24.P$1
U2_POW  (via drill 0.31)
  Top 0.406: JP4.P$2 29.22,23.56 v29.71,23.56 30.02,23.87 30.02,27.85 32.05,29.88 JP16.2
  Bottom 0.406: JP5.P$2 29.71,24.22 v29.71,23.56 30.3,22.97 31.39,22.97 31.76,23.34 R26.P$1
U3_POW
  Bottom 0.406: R3.P$1 41.56,7.23 JP7.P$2 41.52,6.55 41.66,6.4 JP6.P$2 40.01,5.75 38.38,4.12 JP17.2
UART1_RX  (via drill 0.31)
  Bottom 0.152: U2.43 45.38,15.46 46.33,14.51 46.33,10.78 43.28,7.73 42.14,7.73 41.91,7.96 39.17,7.96 36.5,5.29 30.63,5.29 30.25,5.67 28.42,5.67 28.12,5.98 v27.74,5.98 27.58,5.83 26.59,5.83 26.02,5.25 R24.P$2 25.68,4.65 JP20.3
UART2_RX  (via drill 0.31)
  Top 0.152: JP16.4 26.97,25.24 v26.61,24.88
  Bottom 0.152: U2.17 34.01,22.46 32.77,23.71 R26.P$2 32.74,24.31 32.74,24.72 32.46,25 26.74,25 v26.61,24.88
UART2_TX  (via drill 0.31)
  Top 0.152: v27.91,21.24 v27.91,21.25 27.48,21.68 27.48,22.88 29.51,24.91 JP16.3
  Bottom 0.152: U2.16 31.06,20.46 30.28,21.24 v27.91,21.24
UART3_RX  (via drill 0.31)
  Top 0.152: v41.6,8.8 41.6,4.59 JP17.4
  Bottom 0.152: U2.52 40.42,10.28 40.23,10.09 40.23,9.48 40.92,8.8 v41.6,8.8 42.17,8.23 R3.P$2
UART3_TX  (via drill 0.31)
  Top 0.152: v40.77,9.79 40.77,2.89 JP17.3
  Bottom 0.152: U2.51 40.92,9.95 v40.77,9.79
UART5_RX  (via drill 0.31)
  Top 0.152: v31.01,6.13 30.18,5.29 v30.18,4.99 31.05,4.99 JP20.6
  Bottom 0.152: R6.P$2 v30.18,4.99 | v31.01,6.13 36.29,6.13 39.45,9.29 39.45,10.94 U2.54
USB_DM  (via drill 0.31)
  Top 0.152: v13.76,11.34 13.21,11.34 11.55,9.68 7.16,9.68 6.14,8.65 CON_USB_MICRO.PIN_2
  Bottom 0.152: U2.44 42.22,14.96 41.6,15.58 | v13.76,11.34 14.27,11.34 14.61,11.01 23.16,11.01 23.7,10.47 26.44,10.47 27.2,11.24 32.54,11.24 36.88,15.58 41.6,15.58 | 41.6,15.58 41.68,15.58
USB_DP  (via drill 0.31)
  Top 0.152: v14.17,10.68 13,10.68 11.62,9.3 7.39,9.3 6.1,8 CON_USB_MICRO.PIN_3
  Bottom 0.152: U2.45 41.75,14.46 40.99,15.22 37,15.22 32.71,10.93 27.43,10.93 26.59,10.09 23.41,10.09 23.01,10.5 14.35,10.5 v14.17,10.68
USB_VBUS  (via drill 0.31)
  Top 0.406: D3.A 8.64,13.98 v7.85,13.98 5.94,12.07 5.94,9.98 5.26,9.3 CON_USB_MICRO.PIN_1
  Route15 0.406: v7.85,13.98 7.54,13.98 6.55,12.99 6.55,8.65 8.23,6.97 18.59,6.97 20.19,8.57 22.02,8.57 22.33,8.27 23.7,8.27 23.93,8.49 32.77,8.49 34.82,6.44 40.08,6.44 40.54,6.89 40.54,8.42 39.85,9.1 39.85,11.08 42.21,13.45 v42.21,15.73
  Bottom 0.152: v42.21,15.73 42.45,15.96 U2.42
V_BAT
  Top 0.406: R17.P$1 9.93,24.23 JP2.P$2 7,27.01 JP21.2
V_BAT_MEAS  (via drill 0.31)
  Top 0.152: R18.P$1 10.57,22.66 R17.P$2 11.64,23.23 12.3,23.89 18.66,23.89 19.25,23.31 v19.25,22.82
  Bottom 0.152: U2.24 37.92,21.76 37.61,21.45 36.65,21.45 36.07,20.86 33.98,20.86 33.5,21.35 31.37,21.35 30.5,22.21 29.06,22.21 28.35,22.92 19.35,22.92 v19.25,22.82
V_IN  (via drill 0.31)
  Top 0.152: C39.+ 42.31,12.66
  Top 0.406: VREG1.2 44.32,15.94 44.8,16.42 45.3,16.42 C38.P$1 | D3.C 9.11,15.62 C3.P$1 10.07,16.63 10.92,17.48 10.92,18.05 IC9.3 10.14,18.06 9.7,18.5 9.7,19.7 9.96,19.96 IC9.1 10.64,20.23 JP3.P$1 10.08,21.14 9.85,21.38 JP2.P$1 3.31,23.31 JP21.3 | v20.83,7.88 21,7.88 R23.P$2 21.98,8.37 22.25,8.65 22.25,9.33 22.63,9.71 24,9.71 24.31,10.02 24.31,10.78 24.5,10.97 JP8.P$1 | v28.12,22.36 28.14,22.34 JP4.P$1 | 42.31,12.66 43.33,11.64 v43.81,11.64 | 42.31,12.83 42.31,11.32 JP1.P$2
  Top 0.508: VREG1.1 VREG1.2
  Top 0.61: C39.+ 42.31,12.83 42.31,14.28 42.7,14.67 VREG1.1
  Bottom 0.406: 24.51,21.88 IMU.P$2 26.66,21.88 v26.69,21.85 | JP6.P$1 42.59,5.84 v42.59,6.51
  pour Route15 (isolate 0.254): 44.09,11.95 44.09,0 0,0 0,28.82 25.55,28.82 25.55,22.69 28.35,22.69 28.35,20.91 25.04,20.91 23.77,22.18 23.77,27.01 9.04,27.01 6.3,23.66 6.22,8.77 8,6.97 19.33,6.97 20.78,8.42 20.73,8.42 32.46,8.49 32.41,8.47 34.44,6.44 40.28,6.44 41.55,7.71 41.55,11.95
VDDA
  Bottom 0.305: U2.13 31.33,18.96 31.18,19.12 C31.P$2 29.65,19.12 29.4,18.87 28.44,18.87 | C28.+ 28.44,18.87 | 28.44,18.87 L1.P$2
VSS1
  Bottom 0.152: U2.31 41.42,23.81 JP12.P$1
  Bottom 0.406: C7.P$2 41.6,23.84 JP12.P$1
VSS2  (via drill 0.31)
  Top 0.406: JP13.P$1 45.15,13.64 v44.96,13.45 44.69,13.72 C14.P$2
  Bottom 0.305: U2.47 44.94,13.46 v44.96,13.45

### Text on the board
Top: LIA_V1_1_R0 TOP LAYER
Route2: LIA_V1_1_R0 LAYER 2
Route15: LIA_V1_1_R0 LAYER 3
Bottom: LIA_V1_1_R0 BOTTOM LAYER
tPlace: LIA_V1_1_R0 SILK SCREEN TOP | S1 | GND | DRDY | SS | SCK | MISO | MOSI | 3V3 | GND | RX | TX | VCC | GND | SDA | SCL | 3V3 | GND | BAT | BVS | JP2 | SPI1 | UART2 | I2C2 | Lia | V1.1 | S2 | VIN | (C)TR | 2012 | VIN | S3 | CAN | LOW | ALOG2 | ALOG1 | HI | I2C1 | S4 | SCL | L5 | L6 | S5 | L4 | L7 | SDA | L3 | REG3V3 | L2 | VIN | L8 | 3V3 | L1 | CMP2 | LVIN | VS | USB | JTAG | RC | RX | UART3 | S6 | GPIO | S7 | GND | 3V3 | TRST | GND | 3V3 | RX3 | GND | 3V3 | RX5 | GND | RX | PC12 | VCC | TX | S8
bPlace: LIA_V1_1_R0 SILK SCREEN BOTTOM | S1 | 2012 | Lia | CC-BY-SA 3.0 | v1.1 | UAV | Paparazzi | GND | (C)TR | CMP1 | S2 | 3V3 | S3 | ACC_DRDY | GND | ASPIRIN_IMU | V_IN | ACC_CS | MISO | SDA | S4 | MOSI | S5 | SCL | GYRO_DRDY | SCK | MAG_DRDY | GYRO_SS | Robotics | Transition | S6 | GND | 3V3 | S7 | USB | V_IN | S8
tNames: J1&2 | J3&4 | Q1 | JTAG | J5&6 | CON_USB | J7&8
tStop: LIA_V1_0_R0 SOLDER MASK TOP
bStop: LIA_V1_0_R0 SOLDER MASK BOTTOM
tCream: LISA_M_V1_1_R0 SOLDER PASTE TOP
bCream: LISA_M_V1_1_R0 SOLDER PASTE BOTTOM
Reference: (C) 2010-2011 Antoine Drouin <poinix@gmail.com> | Licensed under: | (C) 2010-2012 Piotr Esden-Tempski <piotr@esden.net> | CC-BY-SA 3.0 | (C) 2011 Richard Hatano <rhatano@jobyenergy.com> | (C) 2011-2012 Transition Robotics <info@transition-robotics.com> | http://creativecommons.org/licenses/by-sa/3.0/